# EAGLE board TRACKER SOM EVAL BOARD v1.0 (EAGLE 9.6.2), part 1 of 2
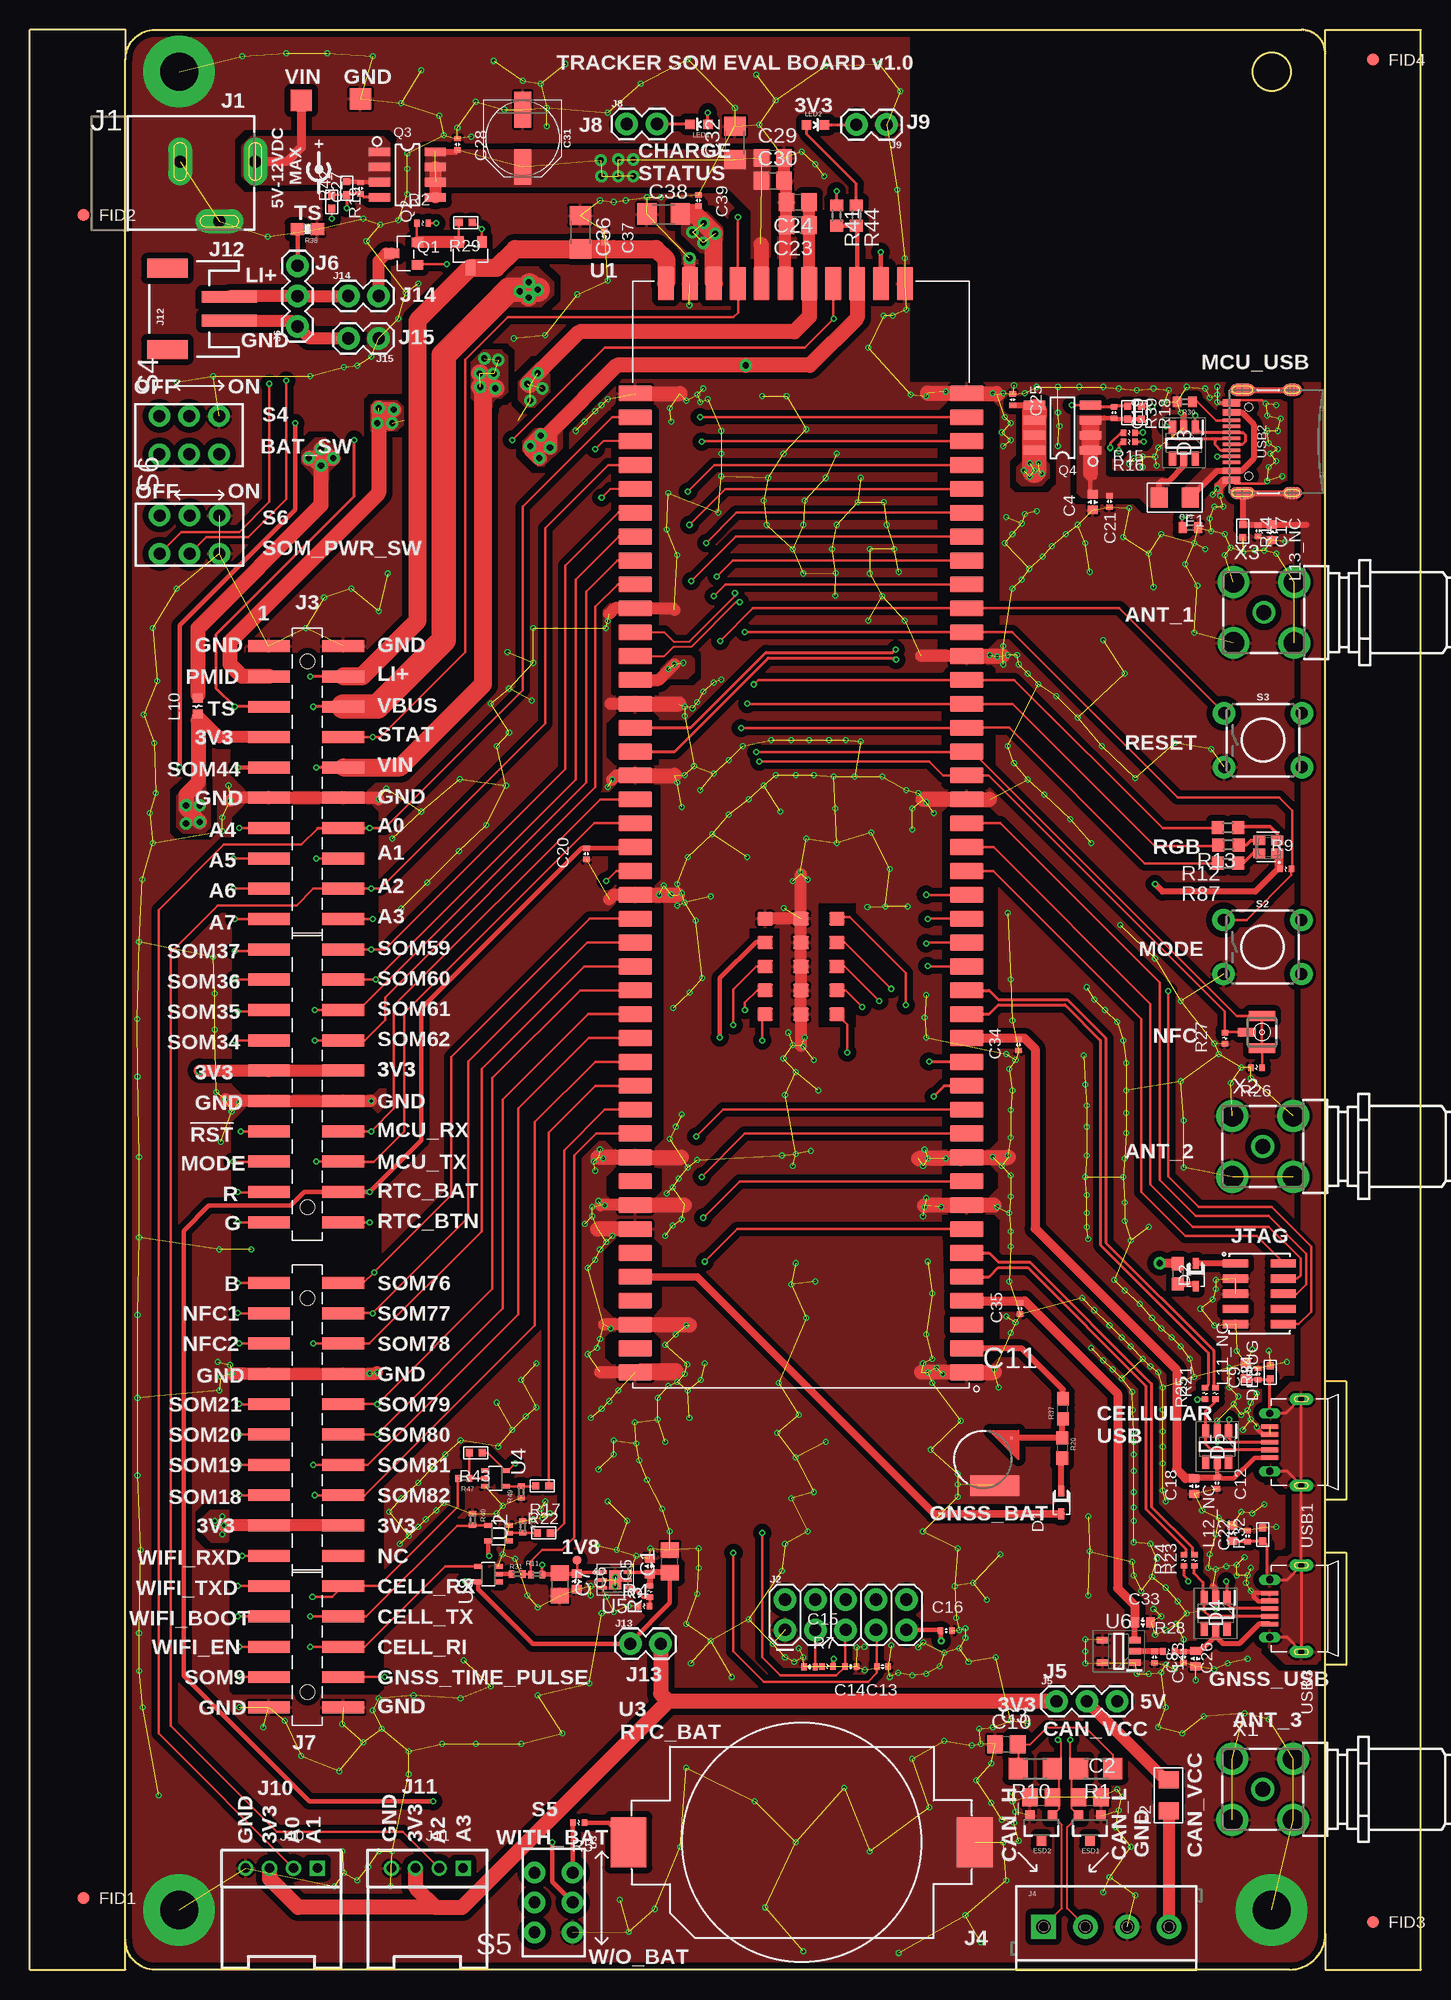
[diagram p5: board, top side]
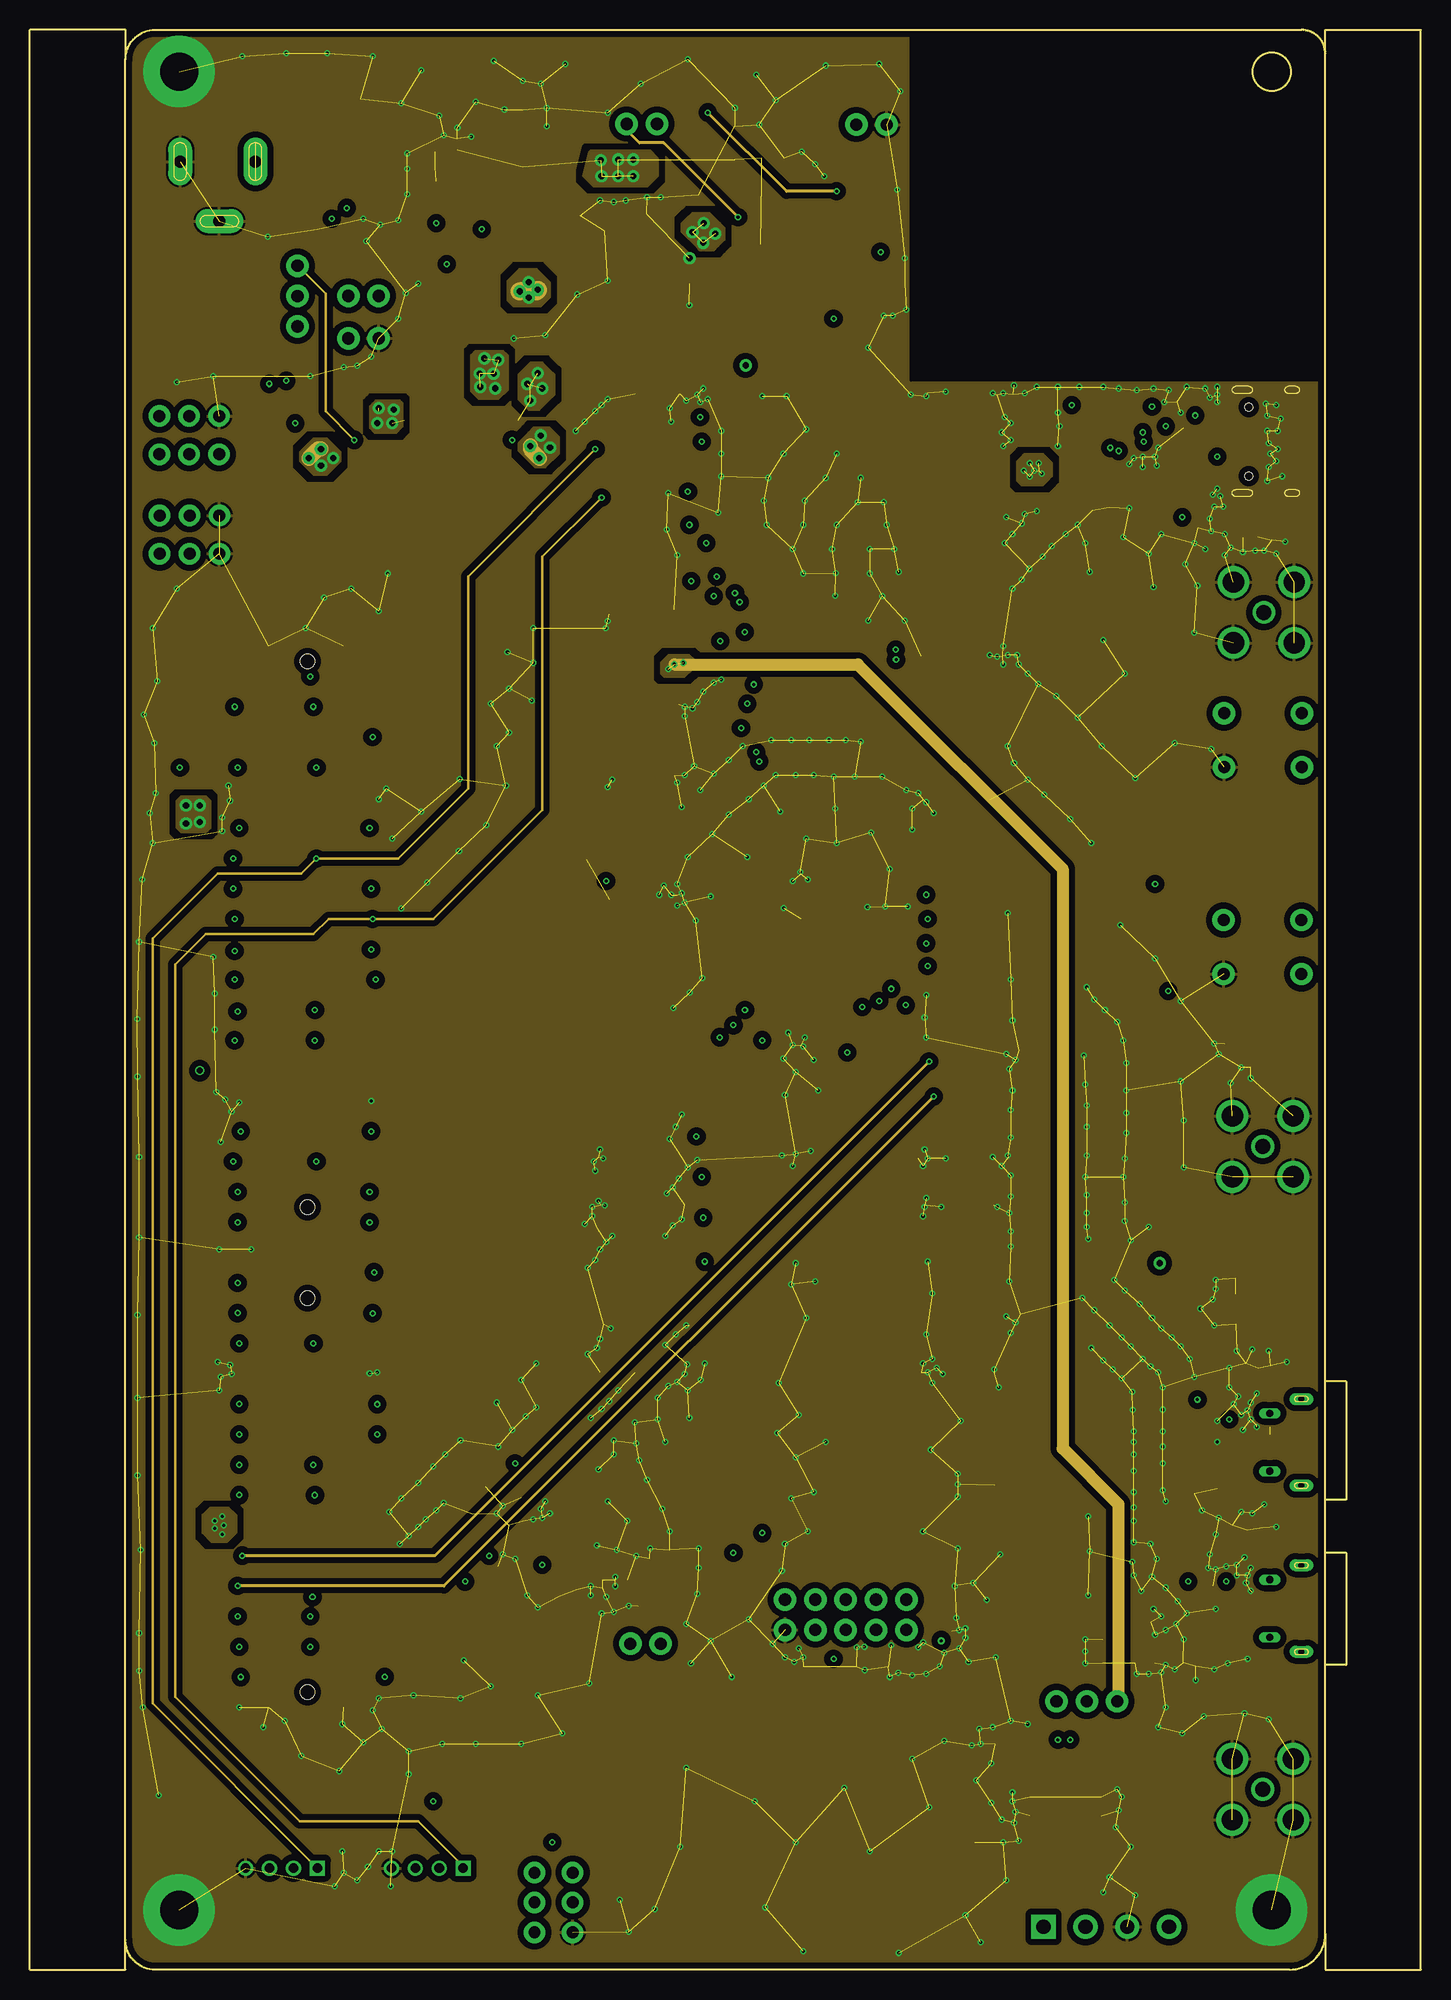
[diagram p6: board, inner layer L2-SIGNAL]
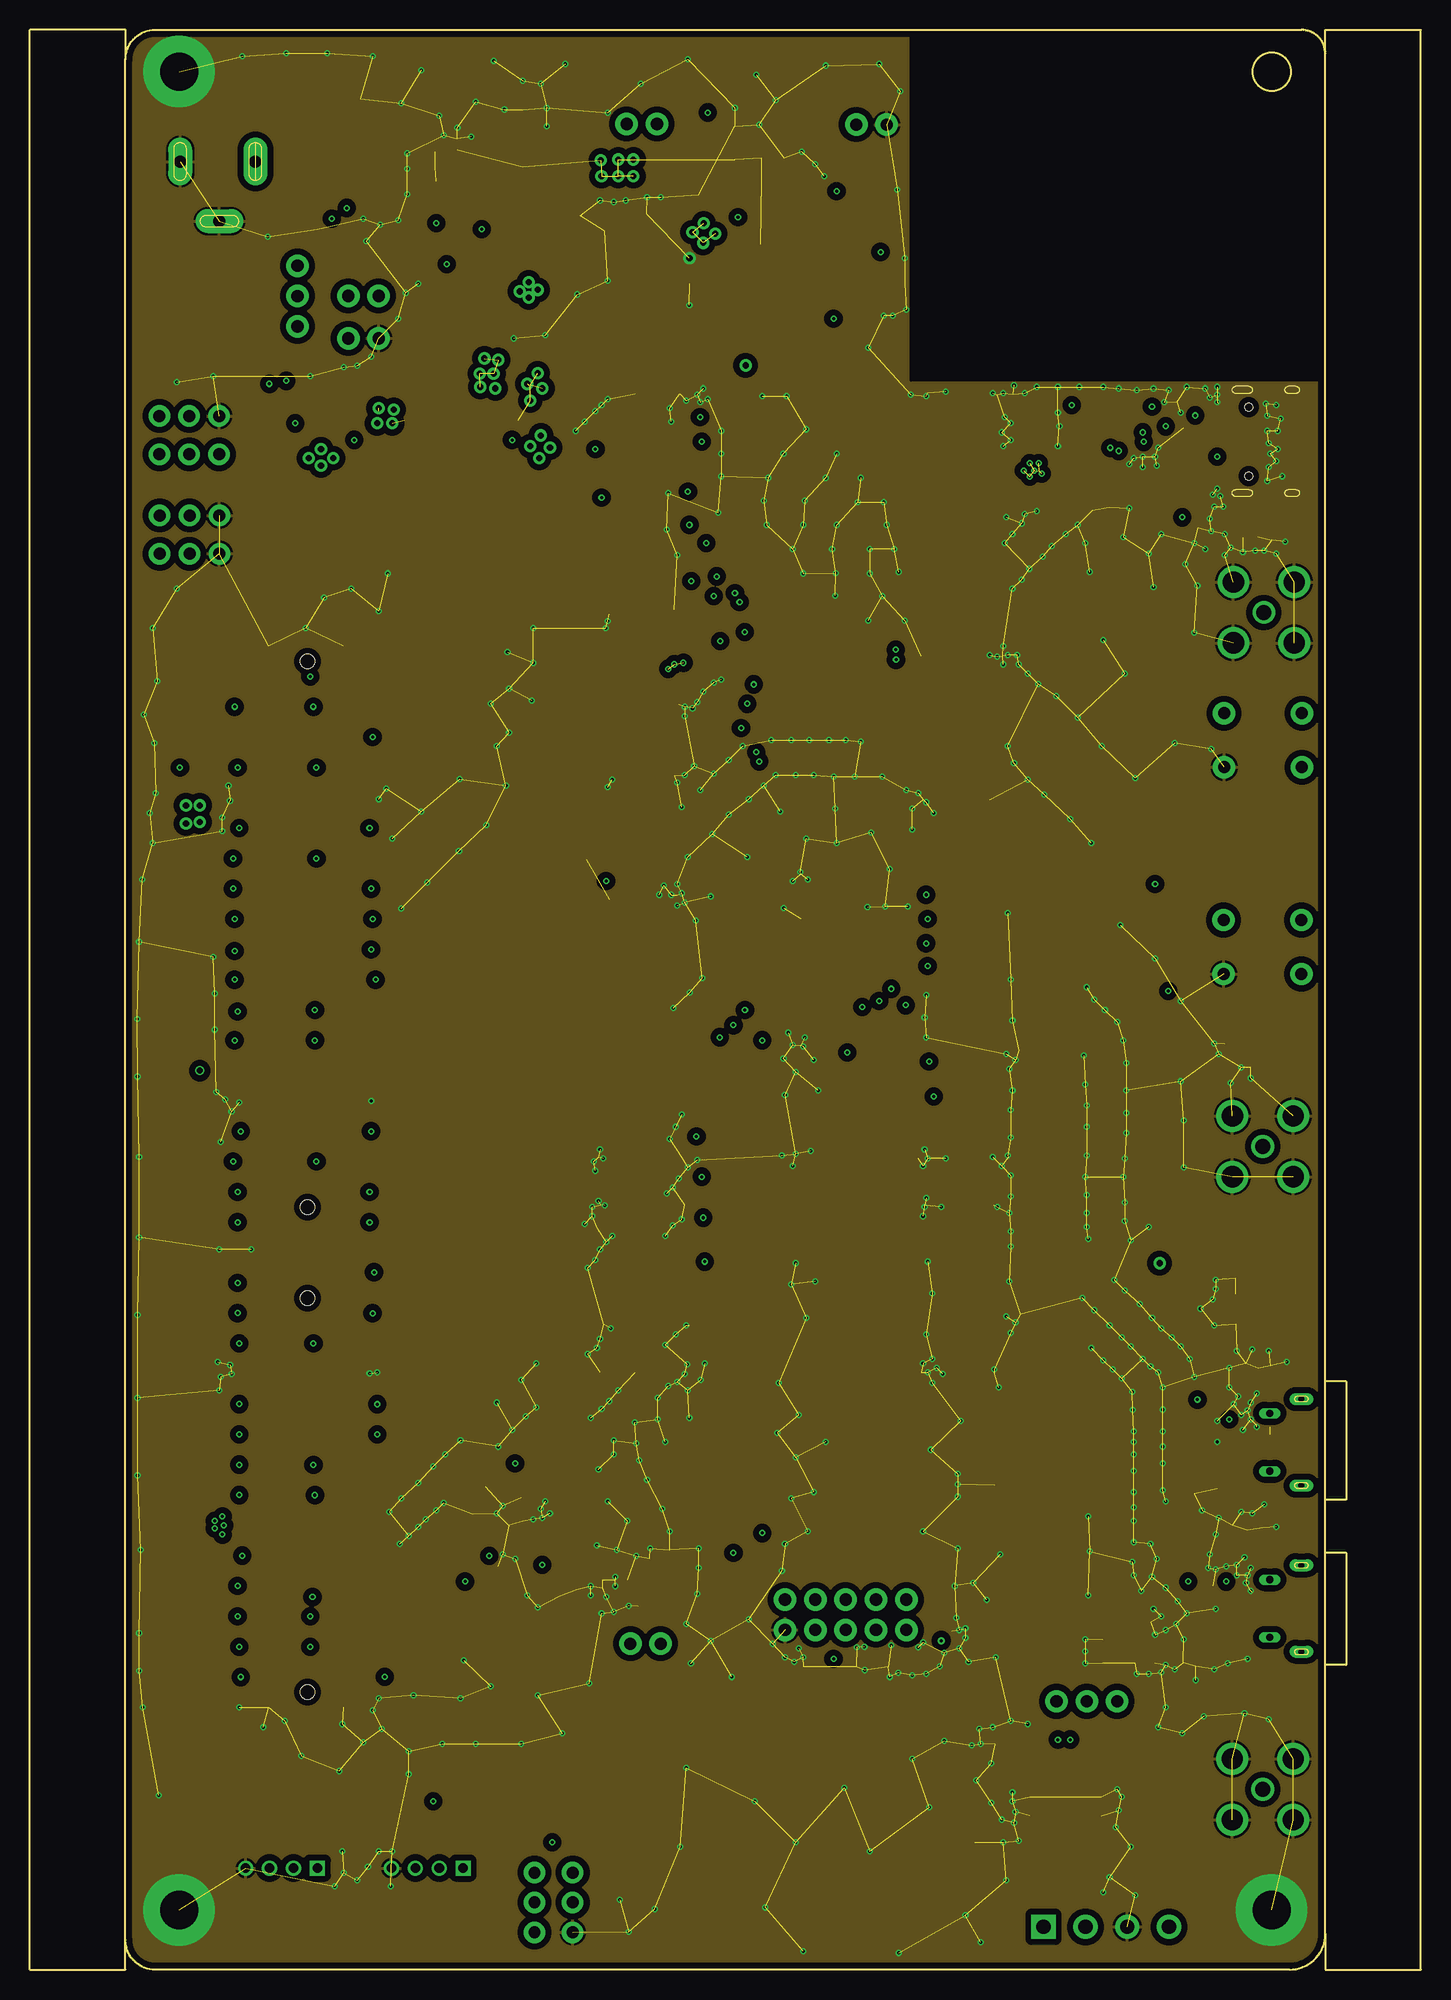
[diagram p7: board, inner layer L5-SIGNAL]
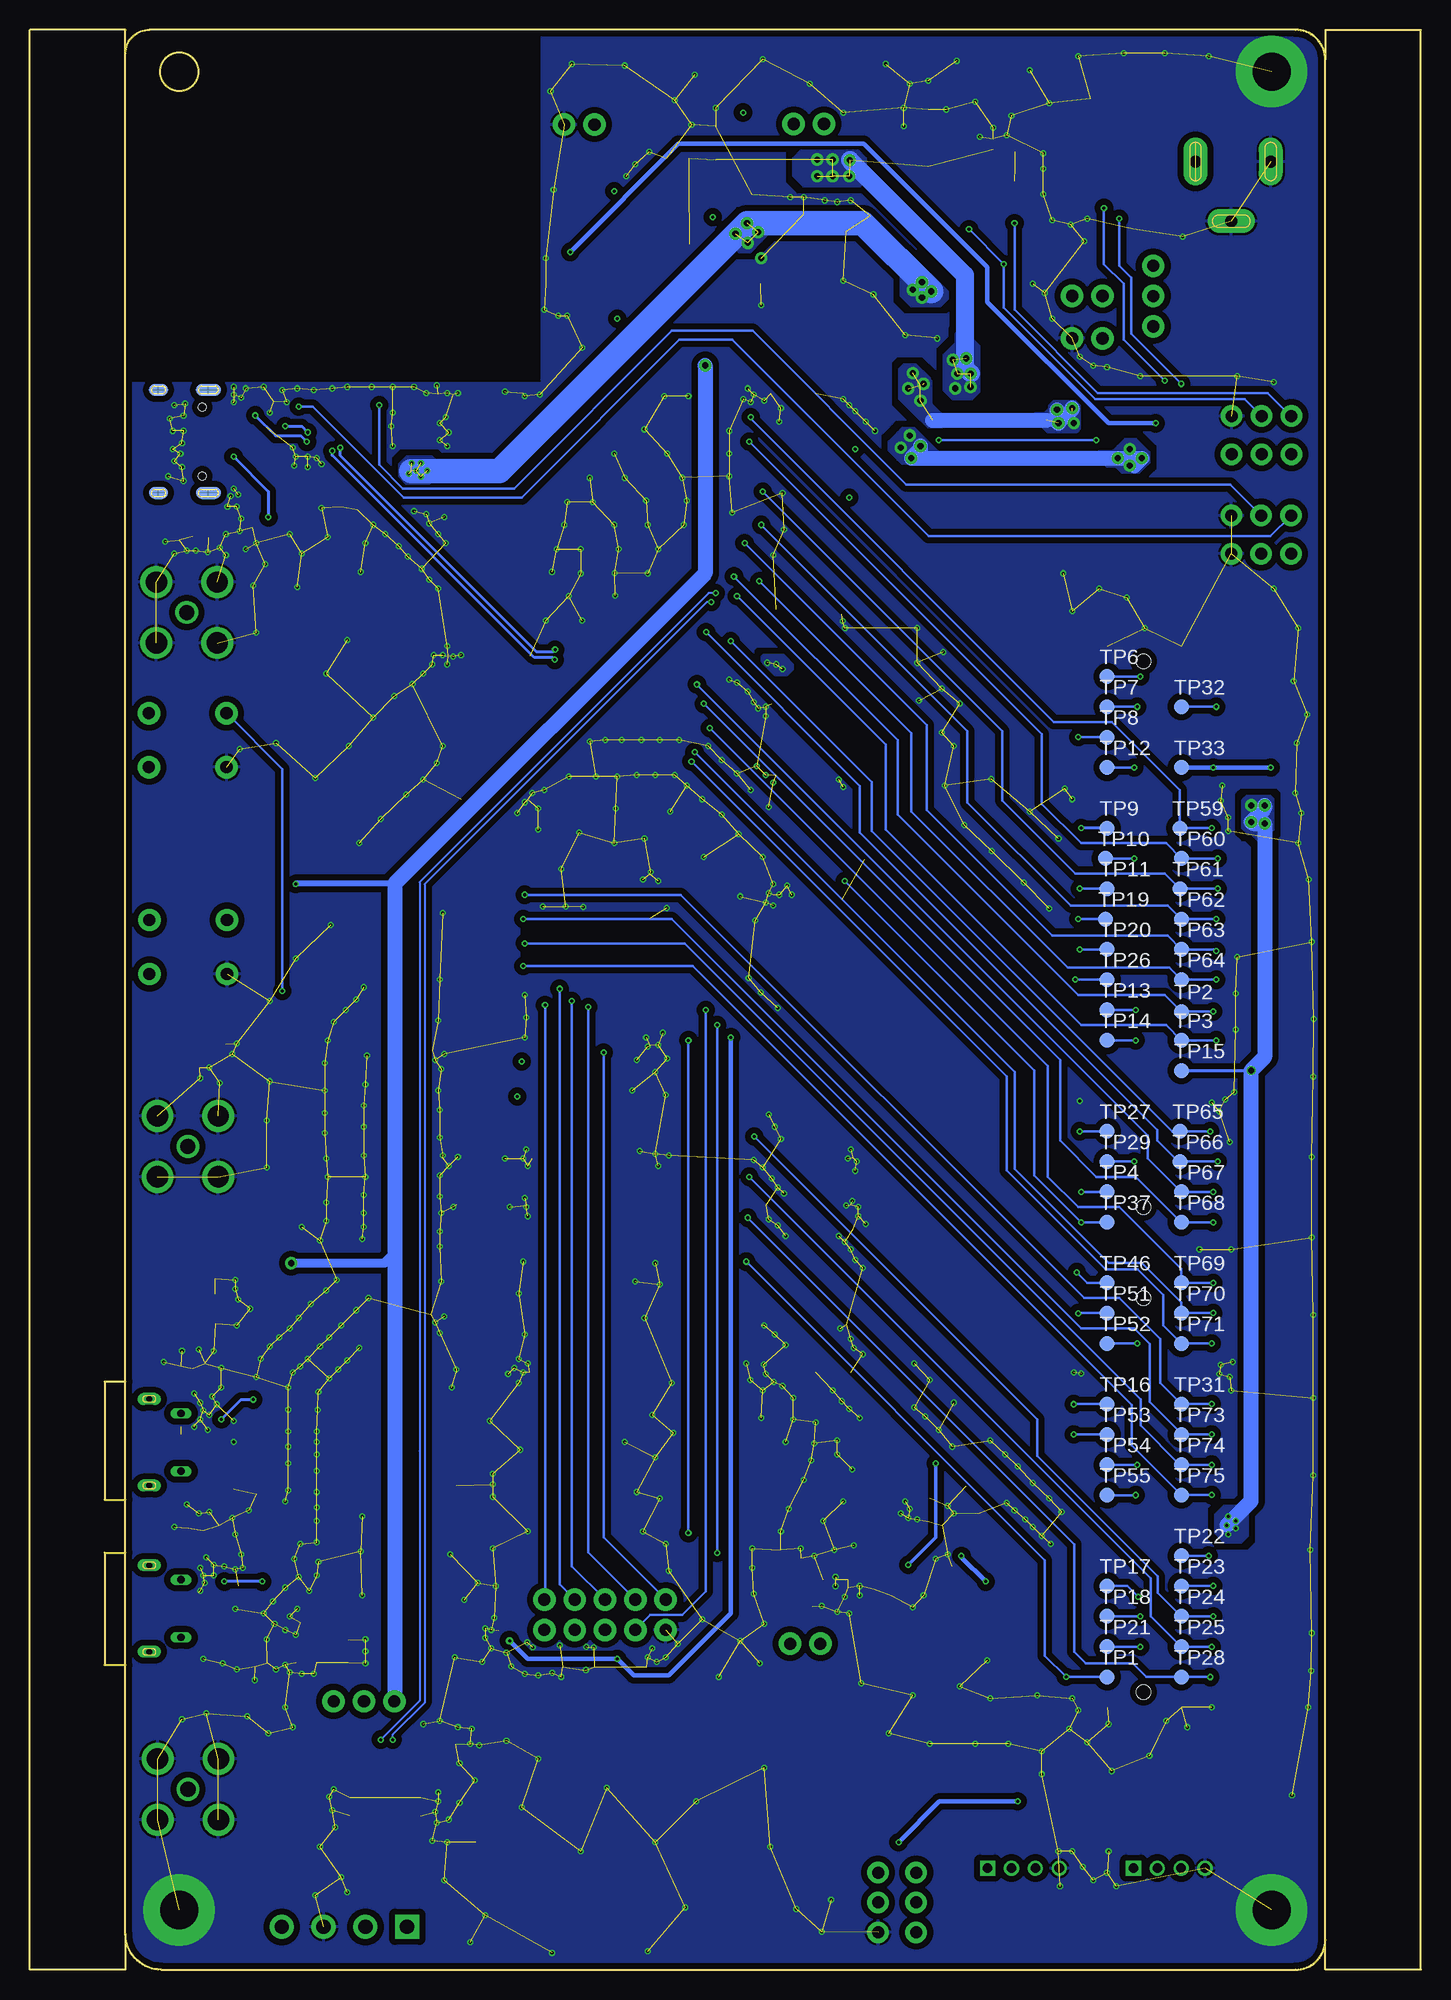
[diagram p8: board, bottom side, seen from below]

Size 116.5 x 162.5 mm. Coordinates in mm from the lower left corner, seen from the top.
Outline: 8,2.5 arc90 10.5,0 105.5,0 arc90 108.5,3
Outline: 8,2.5 8,160
Outline: 8,160 arc-90 10.5,162.5 106.5,162.5 arc-90 108.5,160.5
Outline: 108.5,3 108.5,25.53
Outline: 108.5,25.53 108.5,34.92
Outline: 108.5,34.92 108.5,39.37
Outline: 108.5,39.37 108.5,49.28
Outline: 108.5,49.28 108.5,160.5
Outline: 8,160 8,162.5 0,162.5 0,0 8,0 8,2.5
Outline: 108.5,160.5 108.5,162.5 116.5,162.5 116.5,0 108.5,0 108.5,3
Outline: 108.5,39.37 110.23,39.37 110.23,49.28 108.5,49.28
Outline: 108.5,25.53 110.23,25.53 110.23,34.92 108.5,34.92
Outline: circle at 104,159 radius 1.6
Copper layers (1+2*15+16): L1-TOP 0.035mm / dielectric 0.1mm / L2-SIGNAL 0.0175mm / dielectric 0.365mm / L5-SIGNAL 0.035mm / dielectric 0.1mm / L6-BOTTOM 0.035mm
Design rules "particle-6layer *": minimum track width 4mil, minimum drill 0.1mm, track to track 8mil, track to pad 8mil, pad to pad 6mil, via to via 6mil, smd to smd 0mil, copper to edge 6mil, drill to drill 6mil, minimum pad ring 4mil, minimum via ring 4mil, stop-mask expansion 0mil, vias tented up to drill 20mil, thermal gap 8mil
Net classes: 0 default: width 0.152 mm, clearance 0.152 mm; 2 RF: width 0.203 mm, clearance 0.257 mm; 3 usb_lay3: width 0.152 mm, clearance 0.191 mm; 4 3V3: width 0.305 mm, clearance 0.508 mm; 5 USB_top: width 0.254 mm, drill 0.2 mm, clearance 0.178 mm; 6 +3V3: width 0.203 mm, clearance 0.152 mm; 7 PMID: width 0.305 mm, clearance 0.508 mm; 8 CAN: width 0.152 mm, clearance 0.267 mm
tKeepout: 2 lines

## Footprints (pad centres in the part's own frame; a part is rotated, then mirrored left to right if it is on the bottom)
C0805 = smd 1.3 x 1.5: 1 -0.95,0; 2 0.95,0
REDBEAR_C0603 = smd 0.7 x 0.85: 1 -0.65,0; 2 0.65,0
C0603 = smd 0.7 x 0.85: 1 -0.65,0; 2 0.65,0
PARTICLE-SZ_C-0402 = smd 0.45 x 0.55: 1 -0.47,0; 2 0.47,0
ML414H = smd 0.2 x 0.2: + 2.4,1.8 | smd 4.1 x 1.7: - 1,-2.2
C-0402 = smd 0.45 x 0.55: 1 -0.47,0; 2 0.47,0
PANASONIC_D = smd 3 x 1.4: + 2.4,0; - -2.4,0
C1206 = smd 1.6 x 1.8: 1 -1.4,0; 2 1.4,0
SOD-323 = smd 0.9 x 0.5: 1 -0.95,0; 2 0.95,0
SOT95P280X145-6N = smd 1.15 x 0.6: 1 -1.3,0.95; 2 -1.3,0; 3 -1.3,-0.95; 4 1.3,-0.95; 5 1.3,0; 6 1.3,0.95
CON5X2_1.27 = smd 0.7 x 2.1: 1 -2.54,-2; 2 -2.54,2; 3 -1.27,-2; 4 -1.27,2; 5 0,-2; 6 0,2; 7 1.27,-2; 8 1.27,2; 9 2.54,-2; 10 2.54,2
SOT23-3 = smd 0.8 x 0.9: 1 -0.95,-1; 2 0.95,-1; 3 0,1.1
R1206 = smd 1.4 x 1.7: 1 -1.3,0; 2 1.3,0
FID_TOP_1MM = smd 1 x 1: X 0,0
POWER_JACK_SLOT = drill 1 pad 2 long: GND@1 2.58,7.5; GND@2 7.58,10.8; PWR 2.58,13.8
2X5 = drill 1.016 pad 1.88: 1 0,0; 2 0,2.54; 3 2.54,0; 4 2.54,2.54; 5 5.08,0; 6 5.08,2.54; 7 7.62,0; 8 7.62,2.54; 9 10.16,0; 10 10.16,2.54
SMD_2*20 = smd 1 x 3.5: 1 -1.27,3.013; 2 -1.27,-3.213; 3 1.27,3.013; 4 1.27,-3.213; 5 3.81,3.013; 6 3.81,-3.213; 7 6.35,3.013; 8 6.35,-3.213; 9 8.89,3.013; 10 8.89,-3.213; 11 11.43,3.013; 12 11.43,-3.213; 13 13.97,3.013; 14 13.97,-3.213; 15 16.51,3.013; 16 16.51,-3.213; 17 19.05,3.013; 18 19.05,-3.213; 19 21.59,3.013; 20 21.59,-3.213; 21 24.13,3.013; 22 24.13,-3.213; 23 26.67,3.013; 24 26.67,-3.213; 25 29.21,3.013; 26 29.21,-3.213; 27 31.75,3.013; 28 31.75,-3.213; 29 34.29,3.013; 30 34.29,-3.213; 31 36.83,3.013; 32 36.83,-3.213; 33 39.37,3.013; 34 39.37,-3.213; 35 41.91,3.013; 36 41.91,-3.213; 37 44.45,3.013; 38 44.45,-3.213; 39 46.99,3.013; 40 46.99,-3.213 | hole 1.2: 0,0; 45.72,0
SCREWTERMINAL-3.5MM-4 = drill 1.2 pad 2.032 square: 1 0,0 | drill 1.2 pad 2.032: 2 3.5,0; 3 7,0; 4 10.5,0
1X03 = drill 1.016 pad 1.88: 1 0,0; 2 2.54,0; 3 5.08,0
SMD_2*15 = smd 1 x 3.5: 1 -1.27,3.013; 2 -1.27,-3.213; 3 1.27,3.013; 4 1.27,-3.213; 5 3.81,3.013; 6 3.81,-3.213; 7 6.35,3.013; 8 6.35,-3.213; 9 8.89,3.013; 10 8.89,-3.213; 11 11.43,3.013; 12 11.43,-3.213; 13 13.97,3.013; 14 13.97,-3.213; 15 16.51,3.013; 16 16.51,-3.213; 17 19.05,3.013; 18 19.05,-3.213; 19 21.59,3.013; 20 21.59,-3.213; 21 24.13,3.013; 22 24.13,-3.213; 23 26.67,3.013; 24 26.67,-3.213; 25 29.21,3.013; 26 29.21,-3.213; 27 31.75,3.013; 28 31.75,-3.213; 29 34.29,3.013; 30 34.29,-3.213 | hole 1.2: 0,0; 33.02,0
1X02 = drill 1.016 pad 1.88: 1 0,0; 2 2.54,0
HW4-2.0-90D = drill 0.8 pad 1.27 square: 1 -3,0 | drill 0.8 pad 1.27: 2 -1,0; 3 1,0; 4 3,0
JST-2-SMD = smd 1 x 4.6: 1 -1,-3.7; 2 1,-3.7 | smd 1.6 x 3.4: NC1 -3.4,1.5; NC2 3.4,1.5
R-0603A = smd 0.7 x 0.85: 1 -0.65,0; 2 0.65,0
LED-0603 = smd 0.8 x 0.8: A 0,-0.75; C 0,0.75
IPEX-20279-001E = smd 0.73 x 1.5: 1 0,1.28 | smd 0.8 x 2.2: 2@1 -1.35,0; 2@2 1.35,0
SOT-23 = smd 0.8 x 0.95: 1 -0.95,-1; 2 0.95,-1 | smd 0.8 x 1.25: 3 0,1.15
PMOS_IRF7424 = smd 1.78 x 0.72: 1 -2.34,1.905; 2 -2.34,0.635; 3 -2.34,-0.635; 4 -2.34,-1.905; 5 2.34,-1.905; 6 2.34,-0.635; 7 2.34,0.635; 8 2.34,1.905
R1206' = smd 1.6 x 1.803: 1 -1.422,0; 2 1.422,0
R-0402S = smd 0.45 x 0.55: 1 -0.47,0; 2 0.47,0
R0402_B = smd 0.457 x 0.61: 1 -0.483,0; 2 0.483,0
R0603 = smd 1 x 1.1: 1 -0.85,0; 2 0.85,0
REDBEAR_R0603 = smd 0.6 x 0.6: 1 -0.55,0; 2 0.55,0
R0603' = smd 0.6 x 0.6: 1 -0.55,0; 2 0.55,0
0603 = smd 1.1 x 1: 1 -0.85,0; 2 0.85,0
C0402 = smd 0.7 x 0.9: 1 -0.65,0; 2 0.65,0
0603-RES = smd 1.1 x 1: 1 -0.85,0; 2 0.85,0
PLCC4-2MM-RGB = smd 1 x 0.8: BLUE -0.75,-0.55; CA 0.75,-0.55; GREEN -0.75,0.55; RED 0.75,0.55
TACTILE_SWITCH_PTH_6.0MM = drill 1.016 pad 1.88: 1 -3.251,2.261; 2 3.251,2.261; 3 -3.251,-2.261; 4 3.251,-2.261
SWITCH-2.5X3.2-6 = drill 1 pad 1.8: 1 0,0; 2 0,2.5; 3 0,5; 4 3.2,0; 5 3.2,2.5; 6 3.2,5
B1,27 = smd 1.27 x 1.27: TP 0,0
TRACKER-SOM-3A = smd 2.8 x 1.35: 1 27.9,-91.3; 2 27.9,-89.3; 3 27.9,-87.3; 4 27.9,-85.3; 5 27.9,-83.3; 6 27.9,-81.3; 7 27.9,-79.3; 8 27.9,-77.3; 9 27.9,-75.3; 10 27.9,-73.3; 11 27.9,-71.3; 12 27.9,-69.3; 13 27.9,-67.3; 14 27.9,-65.3; 15 27.9,-63.3; 16 27.9,-61.3; 17 27.9,-59.3; 18 27.9,-57.3; 19 27.9,-55.3; 20 27.9,-53.3; 21 27.9,-51.3; 22 27.9,-49.3; 23 27.9,-47.3; 24 27.9,-45.3; 25 27.9,-43.3; 26 27.9,-41.3; 27 27.9,-39.3; 28 27.9,-37.3; 29 27.9,-35.3; 30 27.9,-33.3; 31 27.9,-31.3; 32 27.9,-29.3; 33 27.9,-27.3; 34 27.9,-25.3; 35 27.9,-23.3; 36 27.9,-21.3; 37 27.9,-19.3; 38 27.9,-17.3; 39 27.9,-15.3; 40 27.9,-13.3; 41 27.9,-11.3; 42 27.9,-9.3; 54 0.1,-9.3; 55 0.1,-11.3; 56 0.1,-13.3; 57 0.1,-15.3; 58 0.1,-17.3; 59 0.1,-19.3; 60 0.1,-21.3; 61 0.1,-23.3; 62 0.1,-25.3; 63 0.1,-27.3; 64 0.1,-29.3; 65 0.1,-31.3; 66 0.1,-33.3; 67 0.1,-35.3; 68 0.1,-37.3; 69 0.1,-39.3; 70 0.1,-41.3; 71 0.1,-43.3; 72 0.1,-45.3; 73 0.1,-47.3; 74 0.1,-49.3; 75 0.1,-51.3; 76 0.1,-53.3; 77 0.1,-55.3; 78 0.1,-57.3; 79 0.1,-59.3; 80 0.1,-61.3; 81 0.1,-63.3; 82 0.1,-65.3; 83 0.1,-67.3; 84 0.1,-69.3; 85 0.1,-71.3; 86 0.1,-73.3; 87 0.1,-75.3; 88 0.1,-77.3; 89 0.1,-79.3; 90 0.1,-81.3; 91 0.1,-83.3; 92 0.1,-85.3; 93 0.1,-87.3; 94 0.1,-89.3; 95 0.1,-91.3 | smd 1.35 x 2.8: 43 22.7,-0.1; 44 20.7,-0.1; 45 18.7,-0.1; 46 16.7,-0.1; 47 14.7,-0.1; 48 12.7,-0.1; 49 10.7,-0.1; 50 8.7,-0.1; 51 6.7,-0.1; 52 4.7,-0.1; 53 2.7,-0.1 | smd 1.3 x 1.1: 96 17,-61.3; 97 17,-59.3; 98 17,-57.3; 99 17,-55.3; 100 17,-53.3; 101 11,-55.3; 102 11,-57.3; 103 11,-59.3; 104 11,-61.3; 105 11,-53.3; 106 14,-53.3; 107 14,-55.3; 108 14,-57.3; 109 14,-59.3; 110 14,-61.3
SC70-5 = smd 0.4 x 0.7: 1 -0.65,-0.85; 2 0,-0.85; 3 0.65,-0.85; 4 0.65,0.85; 5 -0.65,0.85
CR2032_HOLDER = smd 4.2 x 3: + 0,14.5; - 0,-14.5
QFN6P = smd 0.7 x 0.3: 1 -1.05,0.65; 2 -1.05,0; 3 -1.05,-0.65; 4 1.05,-0.65; 5 1.05,0; 6 1.05,0.65 | smd 1 x 1.6: 7 0,0
TLV70433DBVR = smd 1 x 0.55: 1 -1.35,0.95; 2 -1.35,0; 3 -1.35,-0.95; 4 1.35,-0.95; 5 1.35,0.95
TP30_TOP = smd 0.762 x 0.762: P$1 0,0
TP70_BOT = smd 1.778 x 1.778 bottom: P$1 0,0
MICRO_USB = smd 0.4 x 1.4: 1 1.3,0.1; 2 0.65,0.1; 3 0,0.1; 4 -0.65,0.1; 5 -1.3,0.1 | drill 0.6 pad 0.75 long: 6 2.425,0.1 | drill 0.5 pad 1 long: 7 3.625,2.75; 8 -3.625,2.75 | drill 0.6 pad 0.65 long: 9 -2.425,0.1
USB-C-16P = smd 0.3 x 1.45: A5 -1.25,0; A6 -0.25,0; A7 0.25,0; A8 1.25,0; B5 1.75,0; B6 0.75,0; B7 -0.75,0; B8 -1.75,0 | smd 0.6 x 1.45: GND -3.225,0; GND2 3.225,0 | smd 1 x 2.1: SHLD1 -4.32,-0.915; SHLD2 4.32,-0.915 | smd 1 x 2.1 bottom: SHLD3 -4.32,-0.915; SHLD4 4.32,-0.915 | smd 1 x 1.6: SHLD5 -4.32,-5.095; SHLD8 4.32,-5.095 | smd 1 x 1.6 bottom: SHLD6 -4.32,-5.095; SHLD7 4.32,-5.095 | smd 0.55 x 1.45: VBUS1 -2.45,0; VBUS2 2.45,0 | hole 0.65: -2.89,-1.445; 2.89,-1.445
BU-SMA-G = drill 1.27: 1 0,0 | drill 1.778: 2 -2.55,2.55; 3 2.55,2.55; 4 2.55,-2.55; 5 -2.55,-2.55

## Placement (x,y rotation side)
C1  NC  [C0805]  53.6,34.21 90 top
C2  47pF,200V  [C0805]  88.77,14.45 0 top
C3  47pF,200V  [C0805]  84.71,14.45 0 top
C4  10uF 16V  [REDBEAR_C0603]  89.03,122.94 90 top
C5  1uF 16V  [C0603]  51.91,33.79 90 top
C6  1uF 16V  [C0603]  45.82,32.52 270 top
C7  NC  [C0805]  44.37,32.28 270 top
C8  10uF 16V  [REDBEAR_C0603]  97.63,26.06 90 top
C9  0.1uF 16V  [PARTICLE-SZ_C-0402]  102.86,49.9 90 top
C10  4700pF,100V  [C0805]  81.79,18.89 0 top
C11  ML414H-IV01E  [ML414H]  79.8,42.75 0 top
C12  0.1uF 16V  [C-0402]  99.43,40.76 270 top
C13  33pF  [C-0402]  71.41,25.38 180 top
C14  33pF  [C-0402]  68.75,25.38 180 top
C15  33pF  [C-0402]  65.3,25.37 0 top
C16  0.1uF 25V  [C-0402]  76.75,28.4 0 top
C17  0.1uF 16V  [PARTICLE-SZ_C-0402]  102.85,120.53 270 top
C18  10uF 16V  [REDBEAR_C0603]  97.53,40.5 90 top
C19  0.1uF 25V  [C-0402]  90.8,130.43 270 top
C20  NC  [C-0402]  46.61,93.47 90 top
C21  0.1uF 16V  [C-0402]  90.42,122.99 270 top
C22  0.1uF 16V  [PARTICLE-SZ_C-0402]  101.97,36.32 90 top
C23  1uF 16V  [C0805]  64.31,146.14 180 top
C24  1uF 16V  [C0805]  64.31,148.04 180 top
C25  0.1uF 25V  [C-0402]  82.32,131.52 270 top
C26  0.1uF 16V  [C-0402]  96.61,26.19 270 top
C27  0.1uF 25V  [C-0402]  27.68,149.22 90 top
C28  0.1uF 25V  [C-0402]  35.81,152.91 270 top
C29  10uF 16V  [C0805]  62.23,151.76 0 top
C30  10uF 16V  [C0805]  62.23,149.86 0 top
C31  100uF 25V  [PANASONIC_D]  41.27,153.42 270 top
C32  22uF 25V  [C1206]  59.05,153.03 90 top
C33  1uF 16V  [C0603]  93.22,29.08 0 top
C34  NC  [C-0402]  82.8,77.47 90 top
C35  NC  [C-0402]  82.93,55.37 90 top
C36  NC  [C1206]  46.1,145.54 270 top
C37  NC  [C-0402]  48.13,145.16 270 top
C38  NC  [C1206]  53.09,147.07 0 top
C39  NC  [C-0402]  56.01,148.21 270 top
C123  0.1uF 16V  [C-0402]  94.2,26.18 270 top
D1  1N5711WS-7-F  [SOD-323]  86.39,39.14 90 top
D2  B5817WS  [SOD-323]  97.64,58.22 90 top
D3  USBLC6-4SC6Y  [SOT95P280X145-6N]  96.65,127.89 270 top
D4  USBLC6-4SC6Y  [SOT95P280X145-6N]  99.31,29.84 270 top
D5  USBLC6-4SC6Y  [SOT95P280X145-6N]  99.44,43.81 270 top
DEBUG  CON 2X5P  [CON5X2_1.27]  102.97,56.62 270 top
ESD1  MMBZ27VCLT1  [SOT23-3]  88.77,11.91 180 top
ESD2  MMBZ27VCLT1  [SOT23-3]  84.71,11.91 180 top
F1  RF1512-000  [R1206]  95.88,123.32 180 top
F2  1206L035YR  [R1206]  95.38,14.61 90 top
FID1  FIDUCIAL_2  [FID_TOP_1MM]  4.5,6 0 top
FID2  FIDUCIAL_2  [FID_TOP_1MM]  4.5,147 0 top
FID3  FIDUCIAL_2  [FID_TOP_1MM]  112.5,4 0 top
FID4  FIDUCIAL_2  [FID_TOP_1MM]  112.5,160 0 top
J1  POWER_JACKSLT  [POWER_JACK_SLOT]  5.08,154.05 270 top
J2  [2X5]  63.25,28.46 0 top
J3  CONN_20X2_ZHU  [SMD_2*20]  23.24,109.6 270 top
J4  [SCREWTERMINAL-3.5MM-4]  84.9,3.59 0 top
J5  [1X03]  85.98,22.48 0 top
J6  [1X03]  22.42,137.65 90 top
J7  CONN_15X2_ZHU  [SMD_2*15]  23.24,56.26 270 top
J8  [1X02]  49.99,154.61 0 top
J9  [1X02]  71.75,154.56 180 top
J10  4P-2.0-90D  [HW4-2.0-90D]  21.08,8.5 180 top
J11  4P-2.0-90D  [HW4-2.0-90D]  33.29,8.5 180 top
J12  [JST-2-SMD]  13.02,139.12 90 top
J13  [1X02]  50.29,27.3 0 top
J14  [1X02]  26.67,140.21 0 top
J15  [1X02]  29.21,136.65 180 top
L10  GZ1608D300TF  [R-0603A]  14.05,105.84 90 top
L11_NC  NC  [R-0603A]  101.84,50.16 90 top
L12_NC  NC  [R-0603A]  100.7,36.57 90 top
L13_NC  NC  [R-0603A]  104,120.4 270 top
LED1  [LED-0603]  56.05,154.58 90 top
LED2  [LED-0603]  65.81,154.53 270 top
NFC1  UFL  [IPEX-20279-001E]  103.19,78.54 90 top
Q1  IRLML6401TRPBF  [SOT-23]  36.9,143.72 180 top
Q2  IRLML6401TRPBF  [SOT-23]  31.45,143.75 90 top
Q3  IRF7424TRPBF  [PMOS_IRF7424]  31.62,150.37 0 top
Q4  IRF7424TRPBF  [PMOS_IRF7424]  86.49,129.16 180 top
R1  60.4R  [R1206']  89.28,16.86 180 top
R2  100k  [R-0402S]  32.89,146.3 0 top
R3  100k  [R-0402S]  51.92,31.68 90 top
R4  NC  [R-0402S]  51.44,30.45 0 top
R5  1.5k  [R-0402S]  45.97,12.32 180 top
R7  15k  [R-0402S]  66.8,25.4 0 top
R9  20k  [R-0402S]  105.19,92.21 0 top
R10  60.4R  [R1206']  84.2,16.86 180 top
R11  NC  [R0402_B]  42.44,33.1 0 top
R12  1K  [R0603]  100.34,95.67 180 top
R13  1K  [R0603]  100.39,94.22 180 top
R14  1M  [REDBEAR_R0603]  101.57,120.5 270 top
R15  0R  [R-0402S]  92.07,128.75 180 top
R16  0R  [R-0402S]  92.07,127.99 180 top
R17  0R  [R0603']  43.05,36.58 0 top
R18  100K  [R0603']  93.09,130.43 270 top
R19  100K  [R0603']  25.27,148.08 270 top
R20  3.3K  [0603]  86.45,43.7 270 top
R21  0R  [R-0402S]  99.3,48.27 90 top
R22  0R  [R0603']  42.92,40.51 180 top
R23  0R  [R-0402S]  97.53,34.3 90 top
R24  0R  [R-0402S]  96.64,34.3 90 top
R25  0R  [R-0402S]  98.41,48.27 90 top
R26  NC  [R-0402S]  102.73,75.57 180 top
R27  NC  [R-0402S]  100.08,78.03 90 top
R28  0R  [R-0402S]  95.38,26.66 0 top
R29  10M  [R0603']  36.49,146.36 180 top
R30  5.1k  [C0402]  96.72,131.34 180 top
R31  0R  [R0402_B]  40.81,33.14 0 top
R32  1M  [REDBEAR_R0603]  103.24,36.45 90 top
R33  1k  [0603]  96.14,58.29 270 top
R34  1M  [REDBEAR_R0603]  103.88,50.03 90 top
R35  NC  [R0402_B]  41.27,37.08 270 top
R36  5.1k  [C0402]  97.2,120.8 0 top
R37  0R  [0603]  86.53,46.99 90 top
R38  NC  [0603-RES]  23.24,145.8 180 top
R39  10M  [R0603']  91.95,130.43 270 top
R40  NC  [R0402_B]  37.08,37.72 270 top
R41  1K  [R0603]  67.56,146.94 270 top
R42  10M  [R0603']  26.54,149.22 90 top
R43  1M  [REDBEAR_R0603]  37.34,43.31 180 top
R44  1K  [R0603]  69.21,146.94 270 top
R47  0R  [R0402_B]  36.32,41.15 180 top
R49  NC  [R0402_B]  41.15,40.01 90 top
R87  1K  [R0603]  100.34,92.7 180 top
RGB  RGB-LED-CLMVB-FKARGB  [PLCC4-2MM-RGB]  103.71,94.06 0 top
S2  MOMENTARY-SWITCH  [TACTILE_SWITCH_PTH_6.0MM]  103.24,85.67 0 top
S3  MOMENTARY-SWITCH  [TACTILE_SWITCH_PTH_6.0MM]  103.28,102.99 0 top
S4  [SWITCH-2.5X3.2-6]  15.85,126.95 90 top
S5  [SWITCH-2.5X3.2-6]  45.47,8.13 180 top
S6  [SWITCH-2.5X3.2-6]  15.87,118.62 90 top
TP1  TPSB1,27  [B1,27]  26.29,24.52 0 bottom
TP2  TPSB1,27  [B1,27]  20.06,80.26 0 bottom
TP3  TPSB1,27  [B1,27]  20.06,77.85 0 bottom
TP4  TPSB1,27  [B1,27]  26.29,65.15 0 bottom
TP6  TPSB1,27  [B1,27]  26.29,108.33 0 bottom
TP7  TPSB1,27  [B1,27]  26.29,105.79 0 bottom
TP8  TPSB1,27  [B1,27]  26.29,103.25 0 bottom
TP9  TPSB1,27  [B1,27]  26.29,95.63 0 bottom
TP10  TPSB1,27  [B1,27]  26.41,93.09 0 bottom
TP11  TPSB1,27  [B1,27]  26.29,90.55 0 bottom
TP12  TPSB1,27  [B1,27]  26.29,100.71 0 bottom
TP13  TPSB1,27  [B1,27]  26.29,80.39 0 bottom
TP14  TPSB1,27  [B1,27]  26.29,77.85 0 bottom
TP15  TPSB1,27  [B1,27]  20.06,75.31 0 bottom
TP16  TPSB1,27  [B1,27]  26.29,47.38 0 bottom
TP17  TPSB1,27  [B1,27]  26.29,32.14 0 bottom
TP18  TPSB1,27  [B1,27]  26.29,29.6 0 bottom
TP19  TPSB1,27  [B1,27]  26.41,88.01 0 bottom
TP20  TPSB1,27  [B1,27]  26.29,85.47 0 bottom
TP21  TPSB1,27  [B1,27]  26.29,27.06 0 bottom
TP22  TPSB1,27  [B1,27]  20.06,34.68 0 bottom
TP23  TPSB1,27  [B1,27]  20.06,32.14 0 bottom
TP24  TPSB1,27  [B1,27]  20.06,29.6 0 bottom
TP25  TPSB1,27  [B1,27]  20.06,27.06 0 bottom
TP26  TPSB1,27  [B1,27]  26.29,82.93 0 bottom
TP27  TPSB1,27  [B1,27]  26.29,70.23 0 bottom
TP28  TPSB1,27  [B1,27]  20.06,24.52 0 bottom
TP29  TPSB1,27  [B1,27]  26.29,67.69 0 bottom
TP31  TPSB1,27  [B1,27]  20.06,47.38 0 bottom
TP32  TPSB1,27  [B1,27]  20.06,105.79 0 bottom
TP33  TPSB1,27  [B1,27]  20.06,100.71 0 bottom
TP37  TPSB1,27  [B1,27]  26.29,62.61 0 bottom
TP46  TPSB1,27  [B1,27]  26.29,57.54 0 bottom
TP51  TPSB1,27  [B1,27]  26.29,55 0 bottom
TP52  TPSB1,27  [B1,27]  26.29,52.46 0 bottom
TP53  TPSB1,27  [B1,27]  26.29,44.84 0 bottom
TP54  TPSB1,27  [B1,27]  26.29,42.3 0 bottom
TP55  TPSB1,27  [B1,27]  26.29,39.76 0 bottom
TP59  TPSB1,27  [B1,27]  20.19,95.63 0 bottom
TP60  TPSB1,27  [B1,27]  20.06,93.09 0 bottom
TP61  TPSB1,27  [B1,27]  20.19,90.55 0 bottom
TP62  TPSB1,27  [B1,27]  20.06,88.01 0 bottom
TP63  TPSB1,27  [B1,27]  20.06,85.47 0 bottom
TP64  TPSB1,27  [B1,27]  20.06,82.93 0 bottom
TP65  TPSB1,27  [B1,27]  20.19,70.23 0 bottom
TP66  TPSB1,27  [B1,27]  20.19,67.69 0 bottom
TP67  TPSB1,27  [B1,27]  20.06,65.15 0 bottom
TP68  TPSB1,27  [B1,27]  20.06,62.61 0 bottom
TP69  TPSB1,27  [B1,27]  20.06,57.54 0 bottom
TP70  TPSB1,27  [B1,27]  20.06,55 0 bottom
TP71  TPSB1,27  [B1,27]  20.06,52.46 0 bottom
TP73  TPSB1,27  [B1,27]  20.06,44.84 0 bottom
TP74  TPSB1,27  [B1,27]  20.06,42.3 0 bottom
TP75  TPSB1,27  [B1,27]  20.06,39.76 0 bottom
U1  TRACKER-SOM-3A  [TRACKER-SOM-3A]  50.58,141.34 0 top
U2  SN74LV1T34  [SC70-5]  39.24,36.58 90 top
U3  CR2032_HOLDER  [CR2032_HOLDER]  64.64,10.67 90 top
U4  SN74LV1T34  [SC70-5]  38.99,41.15 270 top
U5  LP5910  [QFN6P]  49.02,32.64 0 top
U6  TLV70433DBVR  [TLV70433DBVR]  91.19,26.67 180 top
U8  SN74LV1T34  [SC70-5]  38.4,33.14 90 top
U$4  TP5  [TP30_TOP]  45.83,34.3 180 top
U$9  TP2  [TP70_BOT]  22.73,156.59 0 bottom
U$10  TP2  [TP70_BOT]  27.68,156.72 0 bottom
USB1  MICRO_USB_5P  [MICRO_USB]  103.75,44.19 270 top
USB2  [USB-C-16P]  100.63,128.02 90 top
USB3  MICRO_USB_5P  [MICRO_USB]  103.75,30.25 270 top
X1  NC  [BU-SMA-G]  103.25,15.11 0 top
X2  NC  [BU-SMA-G]  103.26,68.97 0 top
X3  NC  [BU-SMA-G]  103.35,113.69 0 top

## Tracks (layer width: path | path; a pad name or v marks a point on that pad's centre or on a via)
1V8  (via drill 0.25 pad 0.51)
  L1-TOP 0.203: 40.02,41.8 v40.64,42.42 | C6.1 45.83,33.19 45.83,33.27 U$4.P$1 | R43.1 38.33,43.31 U4.5
  L1-TOP 0.254: R11.2 v42.92,33.91 | 44.44,33.29 C7.1
  L1-TOP 0.305: U4.5 40.02,41.8 | U5.1 45.85,33.29 45.83,33.27
  L1-TOP 0.381: C6.1 44.43,33.17 C7.1 44.25,33.1 R11.2
  L6-BOTTOM 0.305: v40.64,42.42 40.64,36.2 v42.92,33.91
3V3  (via drill 0.25 pad 0.51, 0.51 pad 0.51, 0.51 pad 1.02)
  L1-TOP 0.254: L10.1 14.1,105.15 14.1,105.03 14.1,104.65
  L1-TOP 0.381: v14.22,97.54 v13.08,97.54
  L1-TOP 1.016: v14.22,75.31 14.26,75.27 19.99,75.27 J3.30 J3.29 | J7.17 J7.18 v16.26,37.21 | J3.8 15.87,103.25 14.1,105.03
  L1-TOP 1.27: 13.08,98.17 v13.08,97.54 | v13.08,97.54 13.08,97.28 v14.22,96.14 | v13.08,97.54 13.08,98.42 14.1,99.44 14.1,104.65
  L6-BOTTOM 0.254: TP15.TP v14.22,75.31
  L6-BOTTOM 1.27: v16.26,37.22 14.22,39.25 v14.22,75.31 13.08,76.45 v13.08,96.01 14.1,96.01 v14.22,96.14 13.08,97.28 v13.08,97.54
  other vias: 16.13,37.97 15.49,37.59 15.49,36.96 16.13,36.45
  pour L1-TOP (isolate 0.279, no thermals): 13.21,99.19 12.32,98.3 12.32,98.17 12.32,95.76 12.45,95.63 12.83,95.25 14.6,95.25 15.11,95.76 15.11,96.39 15.11,97.66 14.73,98.04 14.73,99.31 14.6,99.44 13.97,99.44 13.46,99.44
  pour L2-SIGNAL (isolate 0.279, no thermals): 12.32,95.76 12.32,97.92 12.45,98.04 12.7,98.3 13.59,98.3 14.73,98.3 14.98,98.04 15.11,97.92 15.11,96.39 15.11,95.63 14.86,95.38 14.73,95.25 13.08,95.25 12.7,95.25 12.57,95.38 12.32,95.63
  pour L6-BOTTOM (isolate 0.279, no thermals): 12.57,94.49 12.57,95.25 12.32,95.5 12.32,98.04 12.45,98.17 12.57,98.3 13.33,98.3 14.6,98.3 14.86,98.04 14.98,97.92 14.98,95.63 14.48,95.12 14.22,95.12 13.59,94.49 13.59,94.23 12.7,94.23 12.57,94.36
  pour L1-TOP (no thermals): 17.52,36.83 16.51,35.81 15.24,35.81 14.48,36.58 14.48,36.83 14.48,37.85 14.86,38.23 15.11,38.48 16.64,38.48 17.52,37.59
  pour L6-BOTTOM (no thermals): 14.48,36.83 14.48,38.35 14.98,38.86 15.87,38.86 16.51,38.86 17.27,38.1 17.27,36.58 16.51,35.81 14.98,35.81 14.48,36.32
  pour L2-SIGNAL (no thermals): 14.48,36.58 14.48,38.1 15.11,38.73 16.64,38.73 17.27,38.1 17.27,36.58 16.51,35.81 15.24,35.81
3V3_UART  (via drill 0.25 pad 0.51)
  L1-TOP 0.254: 51.94,33.17 52.03,33.26
  L1-TOP 0.305: U5.6 52.01,33.29 52.03,33.26
  L1-TOP 0.381: v36.45,32.51 36.47,32.49 U8.5 37.55,31.85 42.12,27.28 50.27,27.28 J13.1 50.29,27.4 53.6,30.71 C1.1 | v38.48,34.67 38.39,34.76 U2.5
  L1-TOP 0.508: R3.2 C5.1 52.03,33.26 C1.1
  L6-BOTTOM 0.381: v38.48,34.67 38.48,34.54 v36.45,32.51
+3V3  (via drill 0.25 pad 0.51, 0.51 pad 1.02)
  L1-TOP 0.254: L10.2 14.05,106.77 14.1,106.81
  L1-TOP 0.381: U1.45 69.28,146.02 R44.2 R41.2
  L1-TOP 0.508: R9.1 104.71,93.25 RGB.CA 104.46,92.14 102.61,90.3 94.87,90.3 v94.23,90.93
  L1-TOP 0.762: R33.1 94.65,59.14 v94.61,59.18
  L1-TOP 1.27: U1.45 69.28,138.35 65.33,134.39 v59.94,134.39 49.17,134.39 43.56,128.78 v43.56,127.51 42.8,128.27 v42.8,128.52 v41.91,127.64 41.91,127.38 v42.67,126.62 | J10.3 20.07,7.59 22.46,5.21 34,5.21 | J11.3 32.29,6.92 34,5.21 | v24.38,125.98 23.75,126.62 v23.37,126.62 v25.4,126.62 25.14,126.62 v24.38,127.38 24.38,122.68 14.1,112.39 14.1,106.81 | J5.1 53.47,22.48 | 34,5.21 36.19,5.21 53.47,22.48 | J13.2 52.83,23.11 53.47,22.48
  L2-SIGNAL 1.27: v24.38,127.38 24.13,127.38 v23.37,126.62 | v41.91,127.64 41.91,127.38 v42.67,126.62
  L6-BOTTOM 0.508: 85.92,90.99 94.17,90.99 v94.23,90.93
  L6-BOTTOM 0.762: v94.61,59.18 86.81,59.18 85.92,60.07
  L6-BOTTOM 1.27: v41.91,127.64 41.91,127.38 v42.67,126.62 v23.37,126.62 24,125.98 | v59.94,134.39 59.94,116.97 85.92,90.99 85.92,60.07 85.92,22.54 J5.1
  pour L1-TOP (isolate 0.279, no thermals): 25.02,124.84 25.02,125.48 25.14,125.6 25.91,126.36 25.91,127 25.91,127.13 25.02,128.02 24.76,128.27 23.88,128.27 22.99,127.38 22.73,127.13 22.73,126.62 22.73,126.24 22.99,125.98 24.13,124.84 24.26,124.84
  pour L1-TOP (isolate 0.279, no thermals): 44.32,129.16 43.94,128.78 43.43,128.78 43.18,129.03 42.29,129.03 41.27,128.02 41.27,127.25 42.54,125.98 43.05,125.98 44.58,127.51 44.58,128.91
  pour L6-BOTTOM (isolate 0.279, no thermals): 26.92,127.25 26.03,127.25 25.78,127.25 25.4,127.64 24.76,128.27 23.88,128.27 22.73,127.13 22.73,127 22.73,126.24 22.86,126.11 23.62,125.35 23.88,125.35 25.02,125.35 25.53,125.86 26.29,125.86 26.92,126.49
  pour L6-BOTTOM (isolate 0.279, no thermals): 41.27,126.11 43.43,126.11 43.81,126.49 44.58,127.25 44.58,127.89 44.58,128.02 43.81,128.78 43.43,129.16 42.42,129.16 41.66,128.4 40.26,127 40.26,126.75 40.89,126.11
  pour L2-SIGNAL (isolate 0.279, no thermals): 23.62,125.35 23.75,125.22 24.51,125.22 24.89,125.22 25.65,125.98 26.03,126.36 26.03,127 26.03,127.13 24.89,128.27 24,128.27 23.75,128.27 22.99,127.51 22.61,127.13 22.61,126.87 22.61,126.36
  pour L2-SIGNAL (isolate 0.279, no thermals): 43.18,125.86 44.32,127 44.32,127.76 44.32,128.4 44.2,128.52 43.56,129.16 42.8,129.16 42.16,129.16 41.78,128.78 40.89,127.89 40.89,127.51 40.89,127.25 41.91,126.24 42.29,125.86
A0  (via drill 0.25 pad 0.51)
  L1-TOP 0.203: U1.55 48.76,130.04 41.27,122.56 41.27,107.19 29.72,95.63 v28.45,95.63 | J10.2 10.79,19.78 10.79,88.77 16.26,94.23 22.73,94.23 24.09,95.59
  L1-TOP 0.254: 24.09,95.59 24.13,95.63 J3.13 v28.45,95.63
  L6-BOTTOM 0.254: TP9.TP v28.45,95.63
A1  (via drill 0.25 pad 0.51)
  L1-TOP 0.152: U1.56 48.03,128.04 v47.37,127.38
  L1-TOP 0.203: J3.15 v24,93.09
  L2-SIGNAL 0.203: v47.37,127.38 36.7,116.71 36.7,98.93 30.86,93.09 v24,93.09 22.73,91.82 15.75,91.82 10.29,86.36 10.29,22.29 J10.1
  L6-BOTTOM 0.203: TP10.TP v24,93.09
A2  (via drill 0.25 pad 0.51)
  L1-TOP 0.203: U1.57 48.44,126.04 43.18,120.78 43.18,104.39 29.34,90.55 v28.57,90.55 J3.17 23.75,90.55 22.35,89.15 15.75,89.15 11.81,85.22 11.81,20.43 20.68,11.56 31.23,11.56 J11.2
  L6-BOTTOM 0.203: TP11.TP v28.57,90.55
A3  (via drill 0.25 pad 0.51)
  L1-TOP 0.152: U1.58 48.6,124.04 v47.88,123.32
  L1-TOP 0.203: J11.1 36.29,8.69 | 26.22,87.97 J3.19 v28.7,88.01
  L2-SIGNAL 0.203: v47.88,123.32 42.92,118.36 42.92,97.16 33.78,88.01 v28.7,88.01 25.02,88.01 23.75,86.74 14.73,86.74 12.19,84.2 12.19,22.86 22.61,12.45 32.51,12.45 36.29,8.67 J11.1
  L6-BOTTOM 0.203: TP19.TP v28.7,88.01
A4  (via drill 0.25 pad 0.51)
  L1-TOP 0.203: U1.41 v56.14,130.04 v56.13,130.05 | J3.14 v17.52,95.63
  L6-BOTTOM 0.203: v56.13,130.05 56.13,129.92 30.73,104.52 25.91,104.52 20.19,98.81 TP59.TP v17.52,95.63
A5  (via drill 0.25 pad 0.51)
  L1-TOP 0.203: U1.40 56.28,128.04 v56.26,128.02 | J3.16 v17.02,93.09
  L6-BOTTOM 0.203: v17.02,93.09 TP60.TP 21.34,94.36 28.45,94.36 31.75,97.66 31.75,103.5 v56.26,128.02
A6  (via drill 0.25 pad 0.51)
  L1-TOP 0.203: U1.39 57.33,126.04 v55.12,123.83 | J3.18 v17.02,90.55
  L6-BOTTOM 0.203: v17.02,90.55 TP61.TP 21.46,91.82 28.95,91.82 35.05,97.92 35.05,103.76 v55.12,123.83
A7  (via drill 0.25 pad 0.51)
  L1-TOP 0.203: U1.38 58.25,124.04 v55.24,121.03 | J3.20 v17.14,88.01
  L6-BOTTOM 0.203: TP62.TP v17.14,88.01 | 20.19,88.01 TP62.TP | TP62.TP 21.21,89.15 29.34,89.15 37.97,97.79 37.97,103.76 v55.24,121.03
B  (via drill 0.25 pad 0.51)
  L1-TOP 0.203: v59.56,104.01 78.06,104.01 U1.28 82.01,104.04 93.38,92.68 99.47,92.68 R87.2 | J7.2 v17.4,57.53
  L6-BOTTOM 0.203: v59.56,104.01 31.24,75.69 31.24,66.42 28.7,63.88 25.26,63.88 20.06,58.68 TP69.TP v17.41,57.54 v17.4,57.53
CAN_5V  (via drill 0.25 pad 0.51)  (2 unrouted)
  L1-TOP 1.016: U1.66 52.67,108.04 v53.97,109.35
  L2-SIGNAL 1.016: v53.97,109.35 69.34,109.35 86.49,92.2 86.49,43.66 91.16,38.98 91.16,22.58 J5.3
  other vias: 53.47,108.97 54.74,109.47
  pour L2-SIGNAL (isolate 0.279, no thermals): 55.62,109.73 55.24,110.11 54.48,110.11 53.47,110.11 53.21,109.86 52.83,109.47 52.83,108.58 53.09,108.33 53.85,108.33 54.86,108.33 55.5,108.97 55.62,109.09
  pour L1-TOP (isolate 0.279, no thermals): 53.34,108.2 55.12,108.2 55.24,108.33 55.62,108.71 55.62,109.6 55.62,109.73 55.37,109.98 54.1,109.98 53.97,109.98 53.59,109.6 53.47,109.6 53.09,109.22 52.83,108.97 52.83,108.71
  pour L6-BOTTOM (isolate 0.279, no thermals): 52.58,109.35 53.34,110.11 53.85,110.11 55.12,110.11 55.24,109.98 55.24,109.6 54.99,109.35 54.1,108.46 53.34,108.46 53.09,108.46 52.7,108.84 52.58,108.97
CAN_N  (via drill 0.25 pad 0.51)
  L1-TOP 0.152: U1.64 53.14,112.04 53.93,111.25 55.24,111.25 59.05,115.06 v59.05,115.32 | J4.2 86.86,5.13 86.86,11.95 ESD1.2 87.25,13.48 87.25,14.73 | v87.12,19.27 87.12,17.6 R1.2 87.82,16.82 87.43,16.82 87.25,16.64 87.25,14.73 | C2.1 87.53,14.45 87.25,14.73
  L6-BOTTOM 0.152: v59.05,115.32 59.65,115.32 83.86,91.11 83.86,43.43 83.86,22.54 v87.12,19.27
CAN_P  (via drill 0.25 pad 0.51)
  L1-TOP 0.152: U1.65 53.14,110.04 53.93,110.83 55.41,110.83 59.14,114.55 v59.44,114.55 | J4.1 86.44,5.13 86.44,12.12 ESD2.1 86.23,13.48 86.23,13.97 85.76,14.45 C3.2 86.23,15.02 86.23,16.51 85.88,16.86 R10.1 86.36,17.6 86.36,19.02 v86.11,19.27
  L6-BOTTOM 0.152: v59.44,114.55 59.82,114.55 83.44,90.93 83.44,22.36 86.11,19.7 v86.11,19.27
CAN_VCC
  L1-TOP 1.016: J4.4 95.38,3.61 F2.1
CELL_GPS_RX  (via drill 0.25 pad 0.51)
  L1-TOP 0.203: R47.2 35.84,38.76 29.21,32.13 J7.21 25.34,31.22 v23.67,31.22
  L6-BOTTOM 0.203: v23.67,31.22 24.59,32.14 TP17.TP
CELL_GPS_TX  (via drill 0.25 pad 0.51)
  L1-TOP 0.203: U2.4 37.09,37.23 R40.2 37.03,37.19 35.78,37.19 28.18,29.59 J7.23 v23.49,29.59
  L6-BOTTOM 0.203: TP18.TP v23.49,29.59
CELL_N
  L1-TOP 0.254: U1.17 80.34,82.04 81.11,81.27 86.89,81.27 90.12,78.04 90.12,60.88 99.14,51.87 99.14,48.91 R21.2
CELL_P
  L1-TOP 0.254: U1.16 80.34,80.04 81.11,80.81 86.7,80.81 89.66,77.85 89.66,60.69 98.68,51.68 98.68,49 R25.2
CELL_RI
  L1-TOP 0.203: U1.85 47.43,70.04 45.59,68.2 45.59,36.2 44.58,35.18 42.92,35.18 41.96,34.21 R11.1
  L1-TOP 0.254: R31.2 41.92,33.14 R11.1
CELL_RI_EXT  (via drill 0.25 pad 0.51)
  L1-TOP 0.203: U8.4 34.79,33.79 28.06,27.05 J7.25 v23.49,27.05
  L6-BOTTOM 0.203: TP21.TP v23.49,27.05
CELL_RX
  L1-TOP 0.203: U1.83 47.37,74.04 43.48,70.15 R22.1 43.43,40.55
CELL_TX
  L1-TOP 0.203: U1.84 48.16,72.04 44.77,68.64 44.77,37.4 43.94,36.58 R17.2
CELL_VBUS
  L1-TOP 0.381: USB1.1 102.58,42.89 100.84,41.15 99.82,41.15 99.44,41.53 | 99.44,41.53 D5.5 | 99.44,41.53 C12.1 | C34.2 82.7,78.04 82.17,78.04
  L1-TOP 0.508: C18.2 97.61,41.24 C12.1
  L1-TOP 0.762: U1.15 82.17,78.04 83.3,78.04 84.2,77.14 84.2,62.08 96.04,50.24 96.04,41.91 96.79,41.15 C18.2
CLK1  (via drill 0.25 pad 0.51)
  L1-TOP 0.203: U1.98 68.23,84.04 v71.12,81.15
  L6-BOTTOM 0.203: v71.12,81.15 71.12,33.79 J2.6
G  (via drill 0.25 pad 0.51)
  L1-TOP 0.203: v60.07,106.05 v60.08,106.04 U1.29 82.3,106.04 94.23,94.11 99.42,94.11 | J3.40 v17.4,62.61
  L1-TOP 0.305: 99.42,94.11 R13.2
  L6-BOTTOM 0.203: v17.4,62.61 TP68.TP 23.88,66.42 27.18,66.42 30.23,69.47 30.23,76.2 v60.07,106.05
GND  (via drill 0.25 pad 0.51, 0.51 pad 1.02, 3.2 pad 6)  (910 unrouted)
  L1-TOP 0.203: USB2.GND2 100.88,131.49 103.21,131.49 v103.5,131.19 | USB2.GND 100.92,124.5 103.42,124.5 v103.63,124.71
  L1-TOP 0.254: D4.2 v99.31,30.23 | D5.2 v99.44,44.2
  L1-TOP 0.305: U5.5 U5.7
  L1-TOP 0.381: USB3.5 102.49,31.55 | 102.49,31.55 102.44,31.55 102.36,31.62 | USB3.4 103.81,30.86 102.87,30.86 102.49,31.24 102.49,31.55 | USB1.4 103.25,44.84 102.74,45.34 102.74,45.59 | USB2.GND2 99.52,131.24
  L1-TOP 0.508: D4.2 99.31,31.88 99.06,32.13 | D5.2 v99.44,45.97 | D3.2 96.65,130.18 v96.39,130.43 | USB2.GND 100.33,124.79 | 100.33,124.79 99.9,124.79 99.44,124.33 v99.44,124.08 | v99.69,123.44 99.69,124.16 100.33,124.79
  L1-TOP 1.016: U1.48 63.28,146.06 C23.2 C24.2 63.36,149.68 C30.2 C29.2 | U1.52 55.28,143.34 v55.24,143.38 | U1.31 74.62,110.04 | U1.25 78.21,98.17 | U1.88 47.78,64.04 | U1.93 48.07,54.04 | U1.95 51.08,50.04 47.75,50.04 | U1.106 64.58,91.76 | 64.58,77.4 U1.110 U1.109 U1.108 U1.106 | U1.107 U1.106 | U1.106 U1.105 | v16.38,72.9 16.51,72.77 J3.32 J3.31 v28.57,72.77 | U1.75 48.89,90.04 48.51,89.66 | 53.97,113.92 53.85,114.04 U1.63 48.99,114.04 48.51,113.56 | U1.67 48.65,106.04 48.64,106.05 | U1.70 49.11,100.04 v48.77,99.69 | v29.21,98.04 29.08,98.17 J3.11 J3.12 17.02,98.17 v16.76,97.92 | v29.08,50.04 28.95,49.91 J7.7 J7.8 v16.89,49.91
  L1-TOP 1.27: U1.54 54.44,132.04 | U1.67 54.36,106.04 | U1.70 54.01,100.04 | U1.75 51.09,90.04 54.23,90.04 | 54.58,68.04 U1.86 47.59,68.04 | 54.83,64.04 U1.88 51.05,64.01 | U1.89 47.56,62.04 | U1.93 55.18,54.04 55.24,53.98 | U1.95 53.98,50.04 54.1,50.16 51.21,50.16 | 74.67,50.04 78.08,50.04 U1.1 80.77,50.04 | 74.93,64.01 78.05,64.01 U1.8 80.74,64.04 | 81.95,68.04 U1.10 77.99,67.94 74.42,67.94 | U1.25 74.81,98.04 | U1.25 78.09,98.04 | 81.47,110.04 U1.31 78.03,109.98 | 81.03,131.95 80.94,132.04 U1.42 75.22,132.04 75.18,132.08 | U1.25 80.39,98.04
  other vias: 49.03,32.13 49.03,32.89 12.5,159 12.5,5 104,5 15.62,73.53 22.73,17.91 40.64,34.42 39.62,34.8 41.66,31.37 64.01,25.78 73.91,24.64 102.23,31.75 23.11,112.39 16.13,96.52 16.13,95.38 16.64,99.19 29.84,98.93 93.09,31.75 92.45,33.02 92.33,34.16 92.45,35.81 92.45,37.59 92.45,38.73 92.45,40.01 92.45,41.78 92.45,43.18 92.45,44.2 92.45,45.09 94.87,42.42 94.87,43.81 94.87,45.09 94.87,40.13 95.12,39.24 98.17,38.48 99.57,37.85 99.31,36.45 102.36,38.23 101.47,38.35 101.73,34.54 104.39,37.08 103.38,38.99 97.53,49.66 94.87,48.79 92.33,48.39 91.44,49.53 90.68,50.29 89.92,51.05 88.9,52.07 90.42,53.98 91.44,52.96 92.2,52.2 93.22,51.18 93.85,50.55 94.49,50.04 97.15,51.18 96.39,52.2 93.98,54.61 94.74,53.72 92.96,55.75 95.63,52.96 91.69,56.9 89.15,55.24 88.14,56.26 90.8,57.78 88.64,61.21 88.52,62.23 88.39,66.42 88.52,68.2 91.69,67.94 91.57,66.42 91.82,70.1 91.82,71.75 91.82,73.66 88.39,74.17 88.52,72.39 88.52,70.61 82.17,72.01 82.3,73.66 82.04,75.44 82.17,69.72 82.17,66.55 82.17,60.58 82.17,61.85 82.04,63.37 82.17,64.77 91.82,75.95 91.57,77.85 91.06,79.38 90.04,80.39 89.15,81.28 88.52,82.3 88.26,76.58 82.3,79.5 82.17,82.93 81.79,76.71 81.91,88.52 82.04,57.66 81.79,54.74 87.76,121.03 86.74,120.27 85.6,119.25 84.83,118.36 83.69,117.35 83.06,116.46 82.3,115.7 55.5,105.66 55.88,106.17 81.91,110.11 62.1,103 63.75,103 65.28,103 66.93,103 68.33,103 69.59,102.87 62.48,100.08 64.13,100.08 65.66,100.08 67.31,99.95 69.09,99.95 71.37,99.95 61.47,99.19 60.2,98.04 58.55,96.77 57.15,95.12 55.12,93.22 54.61,97.41 56.13,98.81 57.28,100.2 58.55,101.35 59.69,102.49 50.67,45.85 48.89,43.18 51.69,41.02 53.21,44.2 55.24,46.23 56.51,50.8 52.96,38.61 48.39,39.24 47.5,35.56 46.86,24 42.54,22.99 38.61,23.75 36.32,25.91 36.07,22.73 31.75,18.29 29.46,20.19 32.13,22.99 34.54,18.92 37.34,18.92 41.15,18.92 44.58,19.81 31.75,16.38 78.61,25.78 77.47,32.13 77.72,35.31 80.14,30.99 80.9,26.16 79.25,15.88 79.63,2.29 81.79,7.49 90.42,7.75 92.2,10.29 96.52,19.81 95.12,21.97 10.79,14.61 9.45,21.97 9.17,25.04 9.14,28.19 9.27,35.18 9.02,41.4 9.02,47.88 9.02,54.86 9.14,61.34 9.14,68.07 9.02,74.8 8.99,79.63 9.14,86.11 9.4,91.31 10.29,94.36 10.03,96.9 10.54,98.55 10.41,102.74 9.52,105.16 10.67,107.95 10.29,112.39 12.32,115.7 24.64,114.94 26.92,115.7 29.97,116.97 29.21,113.79 15.37,133.48 12.32,132.97 19.94,145.16 34.29,155.32 32.77,159.13 38.86,159.89 37.34,156.46 17.78,160.27 24.89,160.53 44.83,159.64 43.31,155.96 51.18,157.99 55.12,160.02 66.67,159.51 71.12,159.64 72.64,149.1 45.85,140.34 48.39,141.48 43.18,136.91 40.51,136.65 71.5,122.94 69.34,122.94 64.9,123.06 61.47,123.06 61.72,121.03 64.77,121.03 67.56,121.03 71.75,121.03 72.39,119 70.36,119 67.18,119 63.88,119 64.77,116.97 67.51,116.99 72.77,117.09 70.36,116.97 67.46,115.11 71.37,115.06 70.23,113.03 73.28,113.03 88.77,117.09 100.08,120.27 94.11,115.82 89.92,111.38 91.69,108.58 95.88,102.74 92.58,99.82 89.79,102.49 87.76,104.9 85.98,106.68 97.53,112.01 97.79,115.95 70.48,95.25 67.56,94.36 65.02,94.74 62.86,97.03 67.44,97.28 60.07,93.22 57.02,89.92 55.75,87.88 72.01,92.2 100.58,74.3 99.57,76.71 96.39,74.42 96.65,71.12 96.65,67.18 96.39,81.15 94.23,84.71 91.31,87.5 88.9,94.36 87.12,96.39 84.96,98.42 82.42,101.09 98.93,102.23 39.11,102.49 39.88,99.19 54.99,131.44 55.88,131.95 56.39,132.46 56.77,131.57 56.13,131.32 54.86,105.03 54.86,105.79 54.23,99.44 54.86,100.08 55.62,100.84 54.99,53.98 54.1,53.21 81.15,48.77 75.56,49.15 75.18,50.04 80.77,50.29 81.91,68.2 75.18,67.94 74.93,68.71 74.8,67.31 75.06,64.64 74.93,63.88 74.8,63.12 81.03,63.88 81.41,67.31 73.41,98.81 73.91,97.28 73.91,95.5 81.91,102.49 83.56,99.69 81.53,132.08 80.64,132.08 75.06,131.83 73.79,131.95 72.9,157.35 48.39,155.57 31.11,156.34 28.7,160.27 21.46,160.53 64.13,59.18 64.13,68.33 64.13,75.18 63.88,77.47 64.77,77.34 61.85,124.97 66.67,124.97 69.59,124.97 63.12,127 67.56,127 65.02,129.03 57.91,128.91 61.34,131.83 63.37,131.83 70.23,135.89 47.88,29.84 48.89,29.97 42.54,30.35 49.15,35.18 50.04,37.59 48.01,67.94 47.37,66.93 47.24,67.69 47.75,68.71 54.61,71.63 54.1,70.61 53.59,69.6 47.62,64.39 47.12,63.88 47.12,63.12 46.48,62.48 48.13,64.01 55.88,67.82 55.12,67.18 54.35,66.29 53.85,65.53 53.34,65.02 46.73,58.8 47.37,59.44 47.75,60.33 48.26,60.96 48.77,61.47 53.21,61.47 53.85,62.36 54.61,62.87 47.75,52.83 47.5,52.07 46.73,51.56 48.64,53.72 73.41,139.06 72.26,138.56 71.5,138.56 55.24,139.45 73.28,143.38 48.39,131.57 47.37,130.56 53.72,90.04 54.61,90.17 54.23,90.93 54.23,89.15 54.86,89.41 52.7,90.04 55.12,48.51 54.86,49.91 76.45,49.91 75.94,50.42 75.56,51.18 74.8,50.8 76.71,67.94 76.33,63.88 80.64,68.07 75.69,96.9 75.06,97.79 81.03,109.98 80.39,110.11 76.71,132.21 47.88,131.06 95.38,132.33 102.74,45.47 102.23,46.1 101.98,46.86 102.74,48.26 102.23,47.5 101.22,48.01 101.09,51.82 102.36,51.94 103.76,51.82 105.28,50.93 91.69,62.74 91.69,64.26 102.23,33.66 101.98,33.02 101.85,32.38 101.09,33.02 101.09,33.91 100.2,33.78 98.81,34.8 82.68,110.11 81.53,110.87 81.53,109.35 82.8,109.35 83.56,108.58 84.45,107.7 43.18,39.24 39.11,38.23 33.15,37.72 34.67,39.12 34.03,38.48 88.39,27.69 92.71,24.77 93.72,24.77 94.74,24.89 95.12,25.53 95.88,25.15 99.19,25.15 100.33,25.65 101.98,26.04 98.3,21.21 94.49,20.32 103.76,20.95 101.73,21.46 94.36,34.42 93.85,35.69 56.39,107.06 57.28,107.82 57.91,108.08 48.39,99.06 53.47,48.9 52.58,47.88 49.27,48.51 48.51,47.62 47.88,46.99 46.99,46.23 48.89,44.32 47.62,41.91 51.05,42.67 52.58,46.1 50.8,44.07 53.21,52.32 42.42,47.12 41.53,46.35 40.38,45.21 39.24,43.81 42.42,50.8 41.15,49.4 39.11,47.5 36.07,44.32 88.52,64.9 88.52,63.37 92.2,61.09 93.72,62.23 100.84,47.37 101.6,45.21 101.47,46.48 100.46,48.77 100.46,50.42 88.39,119.51 69.26,27 69.9,27.03 72.01,24.51 76.58,26.54 77.6,29.46 78.36,28.57 77.85,26.92 78.36,27.81 74.8,36.7 78.99,32.38 77.85,28.45 99.31,33.53 98.68,33.66 64.77,26.16 62.23,27.3 82.3,14.86 82.3,14.1 82.55,13.21 82.42,12.32 82.8,10.79 81.53,10.67 81.41,12.57 80.52,13.97 78.87,18.8 91.44,14.48 91.19,13.34 90.93,11.94 91.06,15.11 92.58,6.22 89.92,6.48 97.66,24.26 99.31,57.78 99.31,57.02 99.06,56.13 99.19,53.98 98.04,55.37 101.47,75.56 99.19,77.6 102.23,74.68 98.42,119 100.08,118.49 100.58,119.13 101.6,118.75 102.61,118.87 48.26,31.24 46.99,32.13 46.99,31.37 50.16,30.48 51.94,35.31 50.8,34.67 53.59,36.7 19.56,20.32 29.21,22.73 27.94,19.05 88.39,25.65 88.39,26.67 96.65,27.69 96.01,28.96 94.74,29.59 83.31,121.92 81.79,121.67 81.66,130.05 82.17,129.54 81.53,127.64 82.17,128.14 81.41,128.78 86.11,130.43 86.23,129.29 86.11,127.64 84.33,132.59 86.11,132.59 87.88,132.59 89.92,132.59 91.19,132.46 64.9,78.11 64.52,91.95 65.15,91.31 63.88,91.19 66.04,73.66 65.66,76.2 63.24,73.28 63.12,76.33 63.5,78.49 65.4,68.58 63.88,67.31 62.99,68.2 65.78,57.66 63.75,57.4 65.02,54.61 75.18,59.31 75.56,56.64 75.06,53.21 75.06,81.66 74.93,79.76 75.06,78.11 95.12,28.45 94.23,28.07 93.98,32.89 95.12,32 94.11,30.23 96.14,30.86 96.9,29.84 46.48,129.67 45.72,128.91 77.72,40.64 77.72,39.62 77.72,41.53 103.38,118.87 104.39,118.62 99.44,132.59 99.44,131.95 99.44,131.32 82.42,132.72 83.31,132.08 83.06,121.16 82.3,120.27 81.66,119.51 84.33,122.17 52.32,5.08 49.4,5.84 50.16,3.17 64.77,1.52 72.77,1.4 78.36,4.57 70.36,9.91 68.2,15.24 64.13,10.67 60.7,14.1 54.99,16.89 54.48,10.29 61.59,5.21 73.91,17.65 17.52,72.64 16.89,71.88 15.37,84.84 15.49,81.79 15.49,78.74 18.54,60.33 15.87,60.33 16,69.34 16.76,50.67 53.09,90.81 74.42,98.55 42.8,38.61 42.16,37.72 42.92,37.85 43.56,38.23 39.62,38.86 32.51,37.08 31.75,36.32 30.99,35.69 30.1,38.35 31.11,39.5 32.51,40.77 33.78,42.16 34.8,43.18 15.75,50.93 16,49.66 15.87,48.51 28.45,49.96 62.74,49.15 64.39,46.48 66.67,44.2 64.13,42.93 62.61,44.96 63.75,39.5 65.66,40.01 65.15,36.7 62.99,33.4 63.24,35.69 63.24,26.16 64.39,26.92 56.01,35.31 56.01,33.66 55.88,31.5 54.99,28.96 57.02,27.56 55.37,25.65 58.8,24.51 60.2,29.34 77.98,45.97 75.44,43.56 81.28,34.8 88.64,37.97 88.77,35.05 88.64,31.37 99.06,123.57 99.19,122.56 94.74,120.27 92.07,122.43 91.57,120.02 93.72,118.62 96.77,117.73 99.95,122.56 79.63,18.92 80.64,20.32 79.5,20.19 80.52,17.27 83.56,20.57 82.17,20.83 76.58,19.18 75.31,13.59 26.16,9.91 29.21,9.91 28.32,8.64 27.43,7.49 26.29,8.13 25.53,6.99 30.23,6.99 30.35,9.91 26.16,20.57 17.52,21.97 21.34,20.83 25.91,16.64 28.7,21.72 47.75,148.21 48.89,148.08 49.91,148.21 51.69,148.46 52.83,148.46 35.81,154.31 36.96,153.54 34.67,153.67 31.62,152.15 31.62,150.88 31.62,148.72 30.86,146.56 29.34,146.18 28.19,144.78 27.94,146.69 28.57,135.13 27.43,134.37 26.29,134.24 23.49,133.48 32.51,141.22 31.5,140.46 30.86,138.3 82.55,76.2 82.55,54.23 82.17,53.34 59.05,155.96 61.09,154.56 64.64,152.27 65.78,151.26 66.55,150.24 62.48,156.59 60.83,158.75 41.27,158.24 39.75,155.83 43.31,154.43 42.8,157.99 57.91,127 57.91,125.09 57.66,122.05 54.23,118.49 53.34,120.65 53.47,123.7 53.72,129.67 53.59,130.81 48.23,112.37 40.13,103.63 42.04,106.3 40.13,107.31 38.61,106.05 35.99,99.75 30.35,94.74 32.77,97.03 38.23,95.89 35.94,93.73 33.27,91.06 31.11,88.9 40,110.36 42.16,112.39 42.16,109.47 105.16,119.63 95,131.32 96.9,132.59 98.42,132.46 98.81,131.7 98.81,121.54 98.93,120.52 97.53,119.51 104.39,131.06 104.77,129.92 103.63,130.18 103.63,128.91 104.52,128.91 104.52,127.38 103.76,127.89 103.76,125.86 104.39,126.36 104.9,125.09 103.89,127 94.49,127.51 94.23,126.75 93.22,126.75 92.45,126.62 92.07,126.11 93.22,125.86 94.36,125.98 94.11,132.46 92.71,132.33 76.2,25.4 75.06,24.77 72.14,27.18 69.93,25.1 72.74,24.87 74.83,27.43 74.4,27 55.04,50.7 54.2,49.23 56.18,49.4 73.53,89.08 71.63,89.05 70.15,89.03 63.14,88.95 56.31,83.06 55.27,81.86 53.87,80.57 94.87,46.91 92.38,46.89 48.41,112.95
  pour L1-TOP (isolate 0.508, rank 3): 13,0 8,0 8,162.5 108.5,162.5 108.5,0
  pour L2-SIGNAL (isolate 0.508, rank 3): 11,0 8,0 8,162.5 108.5,162.5 108.5,0
  pour L5-SIGNAL (isolate 0.508, rank 3): 10,0 8,0 8,162.5 108.5,162.5 108.5,0
  pour L6-BOTTOM (isolate 0.508, rank 3): 8,0 8,162.5 108.5,162.5 108.5,0
  cutout L1-TOP: 56.39,143.26 72.14,143.26 72.39,143 72.39,139.68 72.14,139.43 56.39,139.43
  cutout L1-TOP: 49.15,131.32 51.99,131.32 52.59,130.73 52.59,106.81 48.89,106.81 48.77,106.93 48.77,130.81 49.27,131.32 52.09,131.32
  cutout L1-TOP: 49.15,105.16 52.32,105.16 52.58,104.9 52.58,100.97 49.02,100.97 48.39,101.6 48.39,104.39
  cutout L1-TOP: 50.55,99.19 52.7,99.19 52.7,91.31 52.2,90.81 49.27,90.81 48.51,91.57 48.51,98.55 49.15,99.19 50.67,99.19
  cutout L1-TOP: 49.15,89.28 52.96,89.28 52.96,69.6 52.2,68.83 48.89,68.83 48.01,69.72 48.01,88.14
  cutout L1-TOP: 52.83,67.06 52.83,65.28 52.2,64.64 48.64,64.64 48.39,64.9 48.39,66.42 49.53,67.56
  cutout L1-TOP: 49.27,61.34 52.07,61.34 52.83,60.58 52.83,55.5 52.07,54.74 48.89,54.74 48.13,55.5 48.13,60.2
  cutout L1-TOP: 48.64,53.34 52.2,53.34 52.7,52.83 52.7,50.8 48.77,50.8 48.26,51.31 48.26,52.96
  cutout L1-TOP: 76.83,50.8 80.52,50.8 81.15,51.44 81.15,62.74 80.77,63.12 76.45,63.12
  cutout L1-TOP: 76.45,64.77 80.26,64.77 81.03,65.53 81.03,66.67 80.39,67.31 76.71,67.31 76.58,67.18 76.45,67.18
  cutout L1-TOP: 76.45,68.83 80.39,68.83 81.03,69.47 81.03,96.65 80.39,97.28 76.83,97.28 76.45,96.9
  cutout L1-TOP: 76.07,110.74 80.26,110.74 81.15,111.63 81.15,130.81 80.64,131.32 76.9,131.32 76.07,130.49
  cutout L1-TOP: 17.78,110.24 28.83,110.24 29.08,109.98 29.08,99.69 28.57,99.19 28.19,98.81 26.29,98.81 18.16,98.81 17.52,99.44 16.89,100.08 16.89,109.22 17.78,110.11
  cutout L1-TOP: 18.67,97.54 28.57,97.54 29.08,97.03 29.08,73.79 28.95,73.66 28.7,73.41 25.27,73.41 17.78,73.41 17.02,74.17 17.02,96.52 17.52,97.03 18.03,97.54
  cutout L1-TOP: 18.16,72.14 28.57,72.14 29.34,71.37 29.34,50.57 16.97,50.57 16.97,70.94
  cutout L1-TOP: 76.45,99.31 76.45,108.58 76.83,108.97 77.09,109.22 79.12,109.22 80.52,109.22 80.77,108.97 80.77,99.57 80.52,99.31 80.14,98.93 79.5,98.93 76.71,98.93 76.58,99.06 76.45,99.19
  cutout L1-TOP: 73.79,162.43 73.79,133.1 108.46,133.1 108.46,162.43
  cutout L2-SIGNAL: 73.79,133.1 73.79,162.43 108.46,162.43 108.46,133.1
  cutout L5-SIGNAL: 73.79,133.1 73.79,162.43 108.46,162.43 108.46,133.1
  cutout L6-BOTTOM: 73.79,133.1 73.79,162.43 108.46,162.43 108.46,133.1
  pour L1-TOP (no thermals): 10.54,151.64 10.54,153.92 10.79,154.18 11.05,154.43 12.95,154.43 13.59,154.43 14.98,153.03 14.98,149.73 15.24,149.48 16.26,148.46 16.64,148.08 18.29,148.08 18.54,147.83 18.54,146.94 18.54,145.67 17.65,144.78 13.33,144.78 10.54,147.57
  pour L1-TOP (no thermals): 28.32,136.02 28.32,137.79 28.45,137.92 28.57,138.05 29.72,138.05 30.61,137.16 30.61,136.91 30.61,135.64 30.1,135.13 28.83,135.13 28.7,135.25 28.32,135.64
  cutout L1-TOP: 60.32,78.99 62.74,78.99 62.74,87.12 60.32,87.12
  cutout L6-BOTTOM: 73.3,87.96 73.2,87.86 73.3,87.96 75.31,87.96 75.31,84.07 75.18,83.95 62.48,83.95
  pour L1-TOP (no thermals): 76.58,8.13 76.58,13.21 77.22,13.84 80.39,13.84 81.66,12.57 81.91,12.32 81.91,8.64 81.15,7.87 79.75,7.87 76.83,7.87
  pour L1-TOP (no thermals): 76.71,41.78 82.8,41.78 83.18,41.4 83.82,40.77 83.82,39.75 83.31,39.24 80.39,39.24 77.22,39.24 76.96,39.5 76.58,39.88 76.58,41.78
  cutout L1-TOP: 29.08,78.61 30.1,78.61 30.35,78.36 30.35,74.17 30.1,73.91 29.08,73.91 29.08,78.49 29.21,78.61
  cutout L1-TOP: 66.17,89.28 69.09,89.28 69.09,78.99 66.17,78.99
  cutout L1-TOP: 29.59,47.75 29.59,53.72 37.59,61.72 38.61,61.72 38.73,61.59 38.73,56.13 30.35,47.75
  cutout L1-TOP: 95.12,124.21 96.52,124.21 96.65,124.08 96.65,122.05 95.12,122.05
  cutout L1-TOP: 29.39,49.3 29.56,49.12 29.56,23.52 29.13,23.09 17.04,23.09 16.81,23.32 16.81,49.25 16.86,49.3
  cutout L1-TOP: 94.06,15.21 96.7,15.21 96.7,14 94.36,14 94.32,13.96 94.06,14.22
GNSS_ANT_PWR
  L1-TOP 0.635: U1.91 55.88,58.04 75.73,38.19 D1.1
GNSS_BAT
  L1-TOP 0.508: U1.2 83.09,52.04 86.53,48.6 R37.2
GNSS_N
  L1-TOP 0.254: U1.6 80.34,60.04 81.11,59.27 83.74,59.27 93.93,49.08 93.93,38.79 97.36,35.36 97.36,34.95 R23.2
GNSS_P
  L1-TOP 0.254: U1.5 80.34,58.04 81.11,58.81 83.56,58.81 93.47,48.9 93.47,38.6 96.82,35.24 96.82,34.95 R24.2
GNSS_TIME_PULSE  (via drill 0.25 pad 0.51)
  L1-TOP 0.203: U1.7 59.24,62.04 v56.51,59.31 | J7.27 29.71,24.51 v29.72,24.52
  L6-BOTTOM 0.203: v56.51,59.31 31.5,34.3 31.5,26.3 v29.72,24.52 TP1.TP
GNSS_VBUS
  L1-TOP 0.381: C35.2 82.73,56.04 82.42,56.04
  L1-TOP 0.508: C33.1 92.53,29.05 U6.3
  L1-TOP 0.762: U1.4 82.42,56.04 83.3,56.04 91.11,48.23 91.11,31.95 92.57,30.5 C33.1
LI+  (via drill 0.25 pad 0.51)
  L1-TOP 0.254: J3.3 v23.49,108.33
  L1-TOP 0.381: C36.2 46.65,144.69 C37.2 48.68,144.15 48.89,144.15
  L1-TOP 1.524: U1.53 53.28,143.31 52.45,144.15 48.89,144.15 40.64,144.15 39.07,142.57 Q1.3 32.46,138.13 32.46,112.98 27.81,108.33 J3.3
  L6-BOTTOM 0.203: TP6.TP v23.49,108.33
MCU_N  (via drill 0.25 pad 0.51)
  L1-TOP 0.254: U1.68 55.35,104.04 61.65,110.34 72.29,110.34 v72.52,110.57 | R15.2 91.39,128.75 90.5,127.86 v90.5,127.48
  L6-BOTTOM 0.254: v72.52,110.57 72.71,110.38 74.05,110.38 90.5,126.82 v90.5,127.48
MCU_P  (via drill 0.25 pad 0.51)
  L1-TOP 0.254: U1.69 53.99,102.04 61.83,109.88 72.39,109.88 v72.54,109.73 | R16.2 91.44,127.99 91.19,127.74 v91.19,127.23
  L6-BOTTOM 0.254: v72.54,109.73 72.73,109.92 74.24,109.92 91.19,126.86 v91.19,127.23
MCU_RX  (via drill 0.25 pad 0.51)
  L1-TOP 0.203: U1.71 47.75,98.04 30.48,80.77 30.48,72.14 v28.57,70.23 J3.33
  L6-BOTTOM 0.203: TP27.TP v28.57,70.23
MCU_TX  (via drill 0.25 pad 0.51)
  L1-TOP 0.203: U1.72 47.27,96.04 31.37,80.14 31.37,70.23 28.79,67.65 26.29,67.65 J3.35 v24,67.69
  L6-BOTTOM 0.203: TP29.TP v24,67.69
MISO1  (via drill 0.25 pad 0.51)
  L1-TOP 0.203: U1.97 68.33,82.04 v69.72,80.64
  L6-BOTTOM 0.203: v69.72,80.64 69.72,34.94 J2.4
MODE  (via drill 0.25 pad 0.51)
  L1-TOP 0.203: v17.02,67.69 17.05,67.65 19.99,67.65 J3.36 | v59.87,112.04 U1.32 82.27,112.04 96.14,98.17 104.65,98.17 105.71,97.11 105.71,92.26 R9.2 105.66,91.69 101.9,87.93 S2.1
  L6-BOTTOM 0.203: v59.87,112.04 46.99,99.16 46.99,95.25 22.1,70.36 22.1,69.47 20.32,67.69 TP66.TP v17.02,67.69
MOSI1  (via drill 0.25 pad 0.51)
  L1-TOP 0.203: v68.45,76.83 68.45,79.17 U1.96
  L6-BOTTOM 0.203: v68.45,76.83 68.45,36.21 J2.2
N$1  (via drill 0.25 pad 0.51)
  L1-TOP 0.254: R41.1 v67.56,148.97 | LED1.A 56.77,154.61 v56.77,155.57
  L1-TOP 0.381: R41.1 67.63,147.86
  L2-SIGNAL 0.254: v67.56,148.97 63.37,148.97 v56.77,155.57
N$2
  L1-TOP 0.254: LED1.C 52.56,154.58 J8.2
N$3
  L1-TOP 0.508: D1.2 86.39,42.79 R20.2
N$4
  L1-TOP 0.254: R44.1 69.21,149.61 65.06,153.76 LED2.A
N$6  (via drill 0.25 pad 0.51)
  L1-TOP 0.254: D3.3 95.68,129.19 95.61,129.26 | D3.3 95.7,128.46 95.88,128.27 99.06,128.27 | 99.06,128.27 99.26,128.27 | 99.26,128.27 99.49,128.27 | 99.49,128.27 USB2.A7 | 100.64,127.25 USB2.B7 99.76,127.27 99.26,127.76 99.26,128.07 | R15.1 93.19,128.75 v93.22,128.78 | D3.3 95.22,129.19 v95.12,129.29 | 99.26,128.27 99.26,128.07 | 99.06,128.27 99.26,128.07 | 99.26,128.07 99.29,128.07 99.49,128.27
  L6-BOTTOM 0.254: v95.12,129.29 93.72,129.29 v93.22,128.78
N$7
  L1-TOP 0.254: 69.24,154.53 J9.2 69.19,154.53 LED2.C
N$9
  L1-TOP 0.152: R1.1 90.7,18.01 88.39,20.32 85.22,20.32 83.79,18.89 C10.2 82.78,18.85 R10.2
N$10
  L1-TOP 0.203: R17.1 41.3,36.58 | 41.3,36.58 R35.2 | U2.2 41.3,36.58
N$11  (via drill 0.25 pad 0.51)
  L1-TOP 0.254: R16.1 v93.29,127.99 | D3.1 97.6,129.29 | 97.6,129.29 97.6,130.19 v97.61,130.2 | 97.6,129.29 98.11,128.77 USB2.B6 101.61,128.77 101.8,128.57 101.8,128.02 101.55,127.77 USB2.A6
  L6-BOTTOM 0.254: v97.61,130.2 95.91,128.5 93.8,128.5 v93.29,127.99
N$12
  L1-TOP 0.254: R23.1 97.46,33.75 97.46,33.23 98.24,32.45 98.24,31.27 D4.3 98.36,30.03 98.8,29.6 USB3.2
N$13
  L1-TOP 0.254: USB1.2 98.96,43.54 98.49,44 D5.3 98.49,46.8 99.3,47.62 R21.1
N$14
  L1-TOP 0.381: U8.2 R31.1
N$15
  L1-TOP 0.254: R3.1 51.91,31.2 R4.2
  L1-TOP 0.305: R3.1 51.32,31.21 50.54,31.99 U5.4
N$16
  L1-TOP 0.381: S5.1 45.47,12.28 R5.2
N$17  (via drill 0.25 pad 0.51)
  L1-TOP 0.254: USB1.3 100.72,44.19 100.39,44.52 D5.1 100.39,46.03 v100.46,46.1 | R25.1 98.37,47.75 v97.79,47.75
  L6-BOTTOM 0.254: v100.46,46.1 98.81,47.75 v97.79,47.75
N$18
  L1-TOP 0.508: USB2.VBUS2 101.48,130.47 102.49,129.46 102.49,126.57 101.48,125.57 USB2.VBUS1 99.43,125.57 F1.1
  pour L1-TOP (no thermals): 96.65,124.08 98.3,125.73 99.82,125.73 99.95,125.6 99.95,125.35 99.69,125.35 99.44,125.35 99.06,124.97 97.79,123.7 97.79,123.19 97.15,123.19 97.03,123.32 96.65,123.7
N$19
  L1-TOP 1.016: J14.2 29.21,143.13 29.83,143.75 Q2.3
N$20
  L1-TOP 0.305: RGB.RED 104.46,95.19 103.9,95.75 101.27,95.75 R12.1
N$21  (via drill 0.25 pad 0.51)
  L1-TOP 0.203: R2.2 v34.03,146.3
  L6-BOTTOM 0.203: v34.03,146.3 34.03,139.06 27.05,132.08 12.83,132.08 10.89,130.15 S4.6
N$22
  L1-TOP 0.203: U4.2 R47.1 | R47.1 36.7,41.25 | R47.1 36.79,41.16 R43.2
N$23  (via drill 0.25 pad 0.51)
  L1-TOP 0.254: USB3.3 100.65,30.25 100.26,30.64 D4.1 100.26,32.45 v100.2,32.51 | R24.1 96.64,33.05 96.98,32.72 96.98,32.56 v97.03,32.51
  L6-BOTTOM 0.254: v97.03,32.51 v100.2,32.51
N$24
  L1-TOP 1.016: F2.2 95.09,15.9 J5.2
N$25
  L1-TOP 0.203: R22.2 42.35,40.49 42.29,40.49 | 42.29,40.49 R49.2 39.85,40.49 U4.4 | 42.38,40.57 42.29,40.49
N$26
  L1-TOP 1.016: J12.1 21.95,138.12 J6.1 23.42,136.65 J15.2
N$27  (via drill 0.25 pad 0.51)
  L1-TOP 0.203: v93.98,130.94 93.13,130.94 R18.1
  L6-BOTTOM 0.203: S6.6 12.61,120.08 41.21,120.08 57.66,136.53 62.1,136.53 75.31,123.32 85.19,123.32 92.81,130.94 v93.98,130.94
N$28  (via drill 0.25 pad 0.51)
  L1-TOP 0.203: R19.2 v25.27,146.69 | S6.3 12.68,120.42 17.52,120.42 20.06,122.96 v20.06,132.84
  L6-BOTTOM 0.203: v25.27,146.69 25.27,142.75 24.26,141.73 24.26,137.03 v20.06,132.84
N$29
  L1-TOP 1.016: J12.2 16.79,140.19 J6.2 26.66,140.19 J14.1
  pour L1-TOP (no thermals): 14.48,140.21 19.05,139.7 14.48,139.7
N$30
  L1-TOP 0.508: R28.1 94.89,26.64 C123.1 92.56,26.64 U6.2
N$33
  L1-TOP 0.305: R87.1 101.61,92.7 102.42,93.5 RGB.BLUE
N$34
  L1-TOP 0.305: R13.1 101.86,94.22 102.25,94.61 RGB.GREEN
N$35
  L1-TOP 0.381: R5.1 48.49,12.32 U3.+
N$36